# EAGLE design 220nF (EAGLE 9.6.2)

## Sheet 1 of 2
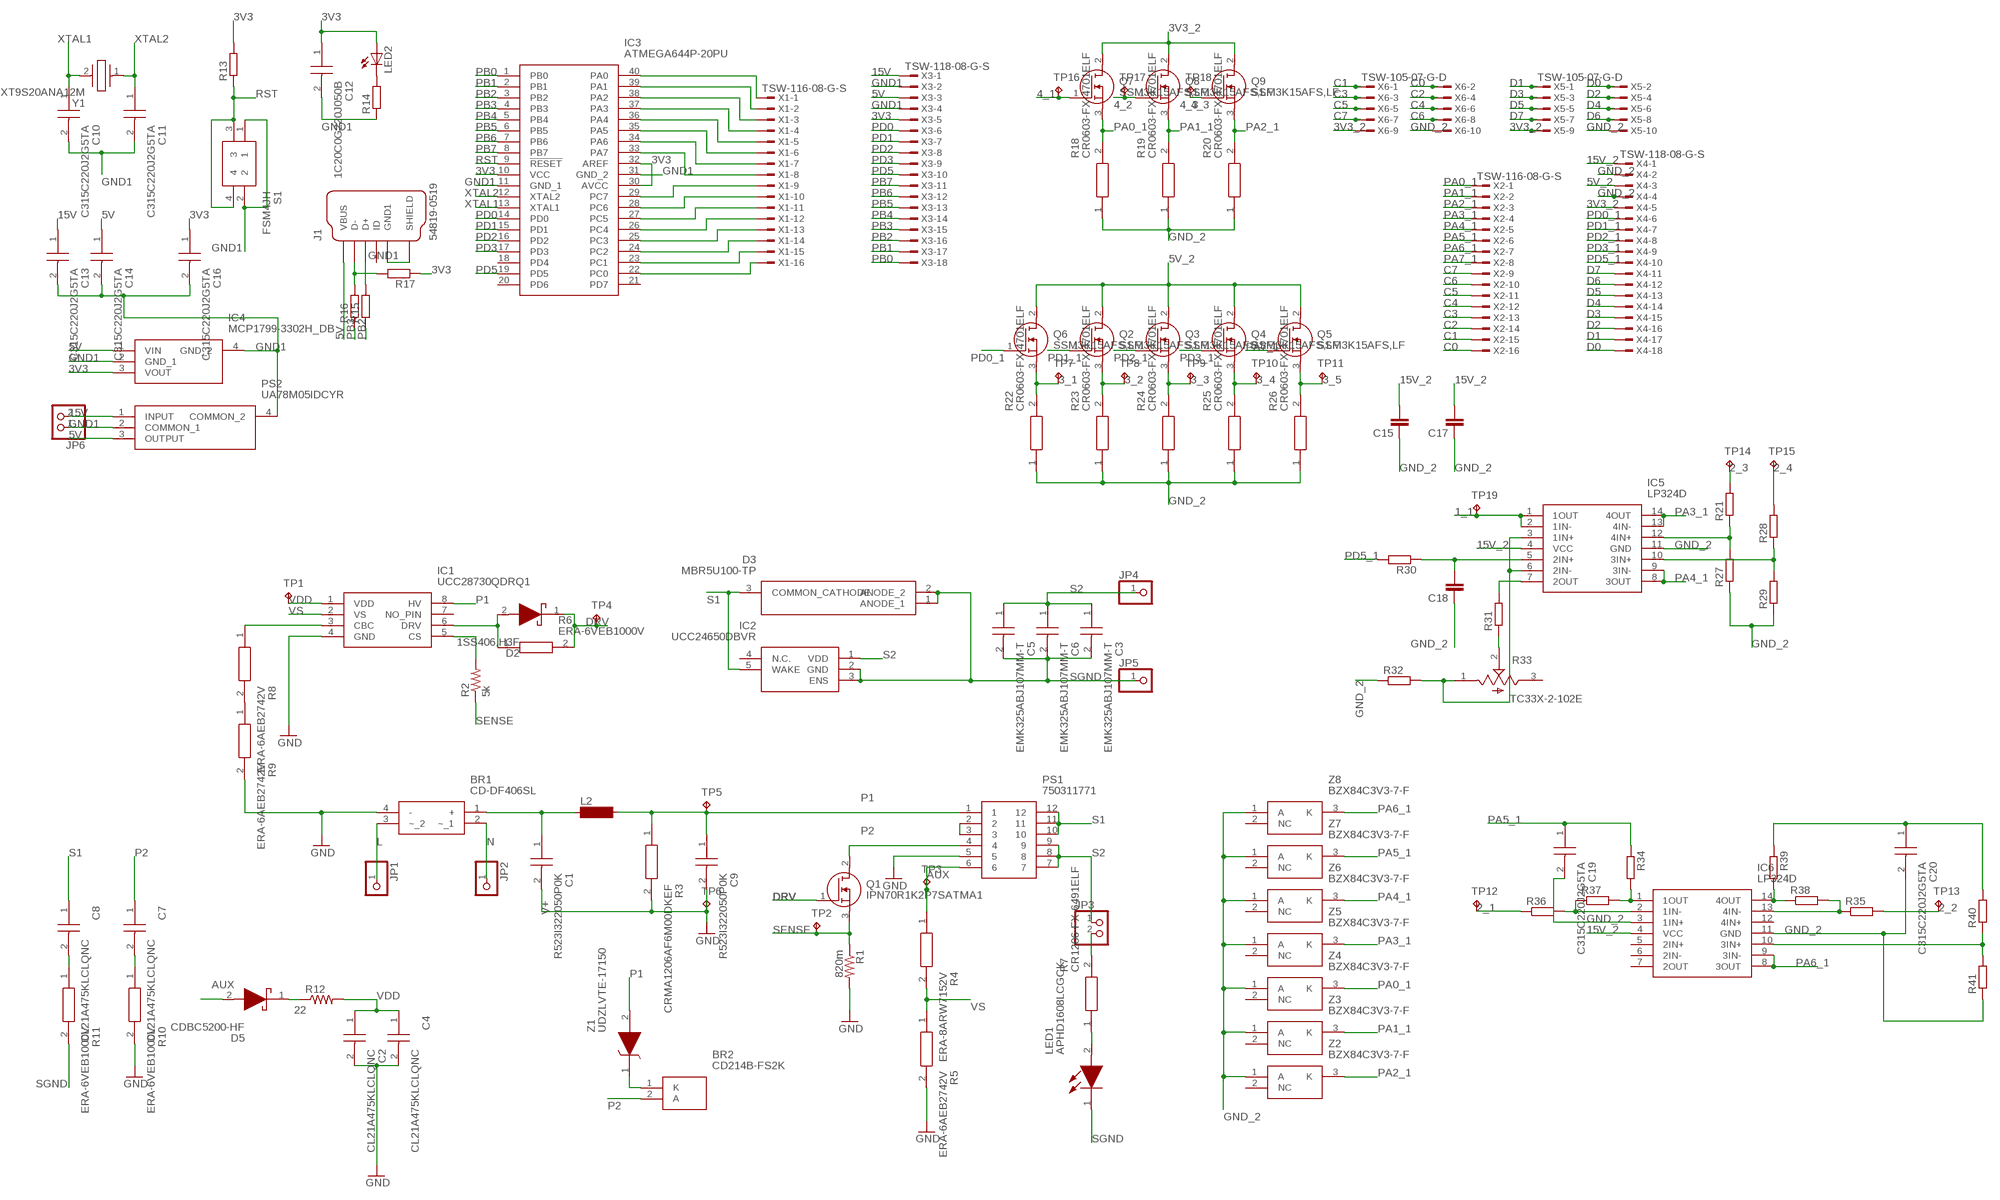
[diagram p0: schematic, sheet 1]

### Parts
BR1  CD-DF406SL  [CDDF406SL]
BR2  CD214B-FS2K  [CD214BFS2K]
C1  R523I322050P0K  [HDRV2W65P0X1500_1X2_1790X585X1]
C2  CL21A475KLCLQNC  [CAPC2012X95N]
C3  EMK325ABJ107MM-T  [CAPC3225X270N]
C4  CL21A475KLCLQNC  [CAPC2012X95N]
C5  EMK325ABJ107MM-T  [CAPC3225X270N]
C6  EMK325ABJ107MM-T  [CAPC3225X270N]
C7  CL21A475KLCLQNC  [CAPC2012X95N]
C8  CL21A475KLCLQNC  [CAPC2012X95N]
C9  R523I322050P0K  [HDRV2W65P0X1500_1X2_1790X585X1]
C10  C315C220J2G5TA  [C315]
C11  C315C220J2G5TA  [C315]
C12  1C20C0G220J050B  [1C20C0G220J050B]
C13  C315C220J2G5TA  [C315]
C14  C315C220J2G5TA  [C315]
C15  C-EUC0805  [C0805]
C16  C315C220J2G5TA  [C315]
C17  C-EUC0805  [C0805]
C18  C-EUC0805  [C0805]
C19  C315C220J2G5TA  [C315]
C20  C315C220J2G5TA  [C315]
D2  1SS406,H3F  [SOD2513X115N]
D3  MBR5U100-TP  [MBR5U100TP]
D5  CDBC5200-HF  [DIOM8059X290N]
IC1  UCC28730QDRQ1  [SOIC127P600X175-8N]
IC2  UCC24650DBVR  [SOT95P280X145-5N]
IC3  ATMEGA644P-20PU  [DIP1556W56P254L5232H483Q40N]
IC4  MCP1799-3302H_DB  [SOT230P700X180-4N]
IC5  LP324D  [SOIC127P600X175-14N]
IC6  LP324D  [SOIC127P600X175-14N]
J1  54819-0519  [MOLEX_54819-0519]
JP1  PINHD-1X1  [1X01]
JP2  PINHD-1X1  [1X01]
JP3  PINHD-1X2  [1X02]
JP4  PINHD-1X1  [1X01]
JP5  PINHD-1X1  [1X01]
JP6  PINHD-1X2  [1X02]
L2  MS50SRU1048-471Y  [INDDFN1000X1000X480-2N]
LED1  APHD1608LCGCK  [LEDM168X80N]
LED2  LED3MM  [LED3MM]
PS1  750311771  [750311771]
PS2  UA78M05IDCYR  [SOT230P700X180-4N]
Q1  IPN70R1K2P7SATMA1  [IPN70R1K2P7SATMA1]
Q2  SSM3K15AFS,LF  [SOT50P160X90-3N]
Q3  SSM3K15AFS,LF  [SOT50P160X90-3N]
Q4  SSM3K15AFS,LF  [SOT50P160X90-3N]
Q5  SSM3K15AFS,LF  [SOT50P160X90-3N]
Q6  SSM3K15AFS,LF  [SOT50P160X90-3N]
Q7  SSM3K15AFS,LF  [SOT50P160X90-3N]
Q8  SSM3K15AFS,LF  [SOT50P160X90-3N]
Q9  SSM3K15AFS,LF  [SOT50P160X90-3N]
R1  820m  R-US_R0805  [R0805]
R2  5k  R-US_R0805  [R0805]
R3  CRMA1206AF6M00DKEF  [RESC3216X74N]
R4  ERA-8ARW7152V  [ERA8A_(0805)]
R5  ERA-6AEB2742V  [ERA6A_(0805)]
R6  ERA-6VEB1000V  [ERA6VK]
R7  CR1206-FX-6491ELF  [RESC3216X75N]
R8  ERA-6AEB2742V  [ERA6A_(0805)]
R9  ERA-6AEB2742V  [ERA6A_(0805)]
R10  ERA-6VEB1000V  [ERA6VK]
R11  ERA-6VEB1000V  [ERA6VK]
R12  22  R-US_R0805  [R0805]
R13  R-EU_0204/7  [0204/7]
R14  R-EU_0204/7  [0204/7]
R15  R-EU_0204/7  [0204/7]
R16  R-EU_0204/7  [0204/7]
R17  R-EU_0204/7  [0204/7]
R18  CR0603-FX-4701ELF  [RESC1608X55N]
R19  CR0603-FX-4701ELF  [RESC1608X55N]
R20  CR0603-FX-4701ELF  [RESC1608X55N]
R21  R-EU_R0805  [R0805]
R22  CR0603-FX-4701ELF  [RESC1608X55N]
R23  CR0603-FX-4701ELF  [RESC1608X55N]
R24  CR0603-FX-4701ELF  [RESC1608X55N]
R25  CR0603-FX-4701ELF  [RESC1608X55N]
R26  CR0603-FX-4701ELF  [RESC1608X55N]
R27  R-EU_R0805  [R0805]
R28  R-EU_R0805  [R0805]
R29  R-EU_R0805  [R0805]
R30  R-EU_R0805  [R0805]
R31  R-EU_R0805  [R0805]
R32  R-EU_R0805  [R0805]
R33  TC33X-2-102E  [TRIM_TC33X-2-102E]
R34  R-EU_0204/7  [0204/7]
R35  R-EU_R0805  [R0805]
R36  R-EU_R0805  [R0805]
R37  R-EU_R0805  [R0805]
R38  R-EU_R0805  [R0805]
R39  R-EU_0204/7  [0204/7]
R40  R-EU_R0805  [R0805]
R41  R-EU_R0805  [R0805]
S1  FSM4JH  [FSM4JH]
TP1  TPB1,27  [B1,27]
TP2  TPB1,27  [B1,27]
TP3  TPB1,27  [B1,27]
TP4  TPB1,27  [B1,27]
TP5  TPB1,27  [B1,27]
TP6  TPB1,27  [B1,27]
TP7  TPB1,27  [B1,27]
TP8  TPB1,27  [B1,27]
TP9  TPB1,27  [B1,27]
TP10  TPB1,27  [B1,27]
TP11  TPB1,27  [B1,27]
TP12  TPB1,27  [B1,27]
TP13  TPB1,27  [B1,27]
TP14  TPB1,27  [B1,27]
TP15  TPB1,27  [B1,27]
TP16  TPB1,27  [B1,27]
TP17  TPB1,27  [B1,27]
TP18  TPB1,27  [B1,27]
TP19  TPB1,27  [B1,27]
X1  TSW-116-08-G-S  [TSW-116-XX-G-S]
X2  TSW-116-08-G-S  [TSW-116-XX-G-S]
X3  TSW-118-08-G-S  [TSW-118-XX-G-S]
X4  TSW-118-08-G-S  [TSW-118-XX-G-S]
X5  TSW-105-07-G-D  [TSW-105-XX-G-D]
X6  TSW-105-07-G-D  [TSW-105-XX-G-D]
Y1  XT9S20ANA12M  [XT9S20ANA12M]
Z1  UDZLVTE-17150  [SODFL2512X90N]
Z2  BZX84C3V3-7-F  [SOT96P240X120-3N]
Z3  BZX84C3V3-7-F  [SOT96P240X120-3N]
Z4  BZX84C3V3-7-F  [SOT96P240X120-3N]
Z5  BZX84C3V3-7-F  [SOT96P240X120-3N]
Z6  BZX84C3V3-7-F  [SOT96P240X120-3N]
Z7  BZX84C3V3-7-F  [SOT96P240X120-3N]
Z8  BZX84C3V3-7-F  [SOT96P240X120-3N]

### Nets
1_1: IC5.1(1OUT) IC5.2(1IN-) TP19.TP
2_1: R36.1 TP12.TP
2_2: R35.2 TP13.TP
2_3: R21.2 TP14.TP
2_4: R28.2 TP15.TP
3_1: Q6.3(S) R22.2 TP7.TP
3_2: Q2.3(S) R23.2 TP8.TP
3_3: Q3.3(S) R24.2 TP9.TP
3_4: Q4.3(S) R25.2 TP10.TP
3_5: Q5.3(S) R26.2 TP11.TP
3V3: C12.1 C16.1 IC3.10(VCC) IC3.30(AVCC) IC3.32(AREF) IC4.3(VOUT) LED2.A R13.2 R17.1 X3.5
3V3_2: Q7.2(D) Q8.2(D) Q9.2(D) X4.5 X5.9 X6.9
4_1: Q7.1(G) TP16.TP
4_2: Q8.1(G) TP17.TP
4_3: Q9.1(G) TP18.TP
5V: C14.1 IC4.1(VIN) J1.1(VBUS) J1.6(VBUS) PS2.3(OUTPUT) X3.3
5V_2: Q2.2(D) Q3.2(D) Q4.2(D) Q5.2(D) Q6.2(D) X4.3
15V: C13.1 JP6.2 PS2.1(INPUT) X3.1
15V_2: C15.2 C17.2 IC5.4(VCC) IC6.4(VCC) X4.1
AUX: D5.2(A) PS1.6 R4.1 TP3.TP
C0: X2.16 X6.2
C1: X2.15 X6.1
C2: X2.14 X6.4
C3: X2.13 X6.3
C4: X2.12 X6.6
C5: X2.11 X6.5
C6: X2.10 X6.8
C7: X2.9 X6.7
D0: X4.18 X5.2
D1: X4.17 X5.1
D2: X4.16 X5.4
D3: X4.15 X5.3
D4: X4.14 X5.6
D5: X4.13 X5.5
D6: X4.12 X5.8
D7: X4.11 X5.7
DRV: D2.1(K) Q1.1(G) R6.2 TP4.TP
GND: BR1.4(-) C1.2 C2.2 C4.2 C9.2 IC1.4(GND) PS1.5 R1.2 R3.2 R5.2 R9.2 R10.2 TP6.TP
GND1: C10.2 C11.2 C12.2 C13.2 C14.2 C16.2 IC3.11(GND_1) IC3.31(GND_2) IC4.2(GND_1) IC4.4(GND_2) J1.5(GND1) J1.10(GND1) J1.11(SHIELD) J1.12(SHIELD) J1.S1(SHIELD) J1.S2(SHIELD) JP6.1 PS2.2(COMMON_1) PS2.4(COMMON_2) R14.1 S1.1 S1.2 X3.2 X3.4
GND_2: C15.1 C17.1 C18.1 C19.2 C20.2 IC5.11(GND) IC6.3(1IN+) IC6.11(GND) R18.1 R19.1 R20.1 R22.1 R23.1 R24.1 R25.1 R26.1 R27.1 R29.1 R32.1 R41.1 X4.2 X4.4 X5.10 X6.10 Z2.1(A) Z3.1(A) Z4.1(A) Z5.1(A) Z6.1(A) Z7.1(A) Z8.1(A)
L: BR1.3(~_2) JP1.1
N: BR1.2(~_1) JP2.1
N$1: IC1.5(CS) R2.2
N$2: C7.2 R10.1
N$3: C8.2 R11.1
N$4: D5.1(K) R12.1
N$5: PS1.2 PS1.3
N$6: BR2.1(K) Z1.1(K)
N$7: D2.2(A) IC1.6(DRV) R6.1
N$8: R8.2 R9.1
N$9: LED1.2(A) R7.1
N$10: IC1.3(CBC) R8.1
N$11: JP3.2 R7.2
N$12: IC3.40(PA0) X1.1
N$13: IC3.39(PA1) X1.2
N$14: IC3.38(PA2) X1.3
N$15: IC3.37(PA3) X1.4
N$16: IC3.36(PA4) X1.5
N$17: IC3.35(PA5) X1.6
N$18: IC3.34(PA6) X1.7
N$19: IC3.33(PA7) X1.8
N$20: IC3.22(PC0) X1.16
N$21: IC3.23(PC1) X1.15
N$22: IC3.24(PC2) X1.14
N$23: IC3.25(PC3) X1.13
N$24: IC3.26(PC4) X1.12
N$25: IC3.27(PC5) X1.11
N$26: IC3.28(PC6) X1.10
N$27: IC3.29(PC7) X1.9
N$28: LED2.K(C) R14.2
N$29: J1.3(D+) J1.8(D+) R15.2
N$30: J1.2(D-) J1.7(D-) R16.2 R17.2
N$31: C18.2 IC5.5(2IN+) R30.1
N$32: IC5.7(2OUT) R31.2
N$33: IC5.12(4IN+) R21.1 R27.2
N$34: IC5.10(3IN+) R28.1 R29.2
N$35: IC5.3(1IN+) IC5.6(2IN-) R32.2 R33.1(CCW)
N$36: R31.1 R33.2(W)
N$37: IC6.14(4OUT) R38.1 R39.2
N$39: IC6.13(4IN-) R35.1 R38.2
N$40: IC6.2(1IN-) R36.2 R37.1
N$41: IC6.1(1OUT) R34.2 R37.2
N$42: C20.1 R39.1 R40.2
N$43: IC6.10(3IN+) R40.1 R41.2
P1: C9.1 IC1.8(HV) L2.2 PS1.1 R3.1 TP5.TP Z1.2(A)
P2: BR2.2(A) C7.1 PS1.4 Q1.2(D)
PA0_1: Q7.3(S) R18.2 X2.1 Z4.3(K)
PA1_1: Q8.3(S) R19.2 X2.2 Z3.3(K)
PA2_1: Q9.3(S) R20.2 X2.3 Z2.3(K)
PA3_1: IC5.13(4IN-) IC5.14(4OUT) X2.4 Z5.3(K)
PA4_1: IC5.8(3OUT) IC5.9(3IN-) X2.5 Z6.3(K)
PA5_1: C19.1 R34.1 X2.6 Z7.3(K)
PA6_1: IC6.8(3OUT) IC6.9(3IN-) X2.7 Z8.3(K)
PA7_1: Q5.1(G) X2.8
PB0: IC3.1(PB0) X3.18
PB1: IC3.2(PB1) X3.17
PB2: IC3.3(PB2) R15.1 X3.16
PB3: IC3.4(PB3) R16.1 X3.15
PB4: IC3.5(PB4) X3.14
PB5: IC3.6(PB5) X3.13
PB6: IC3.7(PB6) X3.12
PB7: IC3.8(PB7) X3.11
PD0: IC3.14(PD0) X3.6
PD0_1: Q6.1(G) X4.6
PD1: IC3.15(PD1) X3.7
PD1_1: Q2.1(G) X4.7
PD2: IC3.16(PD2) X3.8
PD2_1: Q3.1(G) X4.8
PD3: IC3.17(PD3) X3.9
PD3_1: Q4.1(G) X4.9
PD5: IC3.19(PD5) X3.10
PD5_1: R30.2 X4.10
RST: IC3.9(!RESET) R13.1 S1.3 S1.4
S1: C8.1 D3.3(COMMON_CATHODE) IC2.5(WAKE) PS1.10 PS1.11 PS1.12
S2: C3.1 C5.1 C6.1 IC2.1(VDD) JP3.1 JP4.1 PS1.7 PS1.8 PS1.9
SENSE: Q1.3(S) R1.1 R2.1 TP2.TP
SGND: C3.2 C5.2 C6.2 D3.1(ANODE_1) D3.2(ANODE_2) IC2.2(GND) IC2.3(ENS) JP5.1 LED1.1(K) R11.2
V+: BR1.1(+) C1.1 L2.1
VDD: C2.1 C4.1 IC1.1(VDD) R12.2 TP1.TP
VS: IC1.2(VS) R4.2 R5.1
XTAL1: C10.1 IC3.13(XTAL1) Y1.2
XTAL2: C11.1 IC3.12(XTAL2) Y1.1
Unconnected: IC1.7(NO_PIN) IC2.4(N.C.) IC3.18(PD4) IC3.20(PD6) IC3.21(PD7) IC6.5(2IN+) IC6.6(2IN-) IC6.7(2OUT) IC6.12(4IN+) J1.4(ID) J1.9(ID) R33.3(CW) Z2.2(NC) Z3.2(NC) Z4.2(NC) Z5.2(NC) Z6.2(NC) Z7.2(NC) Z8.2(NC)

## Sheet 2 of 2

## Library data of the parts
BR1 = CD-DF406SL:CD-DF406SL: Bridge Rectifiers VRRM 600V 4A SMD DFS Bridge Rectifier Source: Datasheet <http://www.bourns.com/docs/Product-Datasheets/CD-DF4xxSL.pdf>; DESCRIPTION: Bridge Rectifiers VRRM 600V 4A SMD DFS Bridge Rectifier; HEIGHT: 1.55mm; MANUFACTURER_NAME: Bourns; MANUFACTURER_PART_NUMBER: CD-DF406SL; MOUSER_PART_NUMBER: 652-CD-DF406SL; MOUSER_PRICE-STOCK: https://www.mouser.co.uk/ProductDetail/Bourns/CD-DF406SL?qs=zwwtnr6GuIwJRuaaRN0u3A%3D%3D
BR2 = CD214B-FS2K:CD214B-FS2K: Rectifiers 800V 2A Source: Datasheet <http://www.bourns.com/docs/product-datasheets/CD214B-FS2x.pdf>; DESCRIPTION: Rectifiers 800V 2A; HEIGHT: 1.25mm; MANUFACTURER_NAME: Bourns; MANUFACTURER_PART_NUMBER: CD214B-FS2K; MOUSER_PART_NUMBER: 652-CD214B-FS2K; MOUSER_PRICE-STOCK: https://www.mouser.co.uk/ProductDetail/Bourns/CD214B-FS2K?qs=f9yNj16SXrLQSBa%252BXyEv0g%3D%3D
C1 C9 = R523I322050P0K:R523I322050P0K: R52 310 VAC MINI, Film, Metallized Polypropylene, Automotive Safety, 0.22 uF, 10%, 310 VAC, 310 VAC (X2), 310 VAC, 630 VDC, 110C, -40C, 110C, 0.2 % , 100 GOhms, 400 V/us, 2, 1.6 g, 18mm, 12mm, 6mm, Lead Spacing = 15mm, 900 Source: Datasheet <https://content.kemet.com/datasheets/KEM_F3123_R52_X2_310_110C_MIN.pdf>; DESCRIPTION: R52 310 VAC MINI, Film, Metallized Polypropylene, Automotive Safety, 0.22 uF, 10%, 310 VAC, 310 VAC (X2), 310 VAC, 630 VDC, 110C, -40C, 110C, 0.2 % , 100 GOhms, 400 V/us, 2, 1.6 g, 18mm, 12mm, 6mm, Lead Spacing = 15mm, 900; HEIGHT: 12.4mm; MANUFACTURER_NAME: KEMET; MANUFACTURER_PART_NUMBER: R523I322050P0K
C2 C4 C7 C8 = CL21A475KLCLQNC:CL21A475KLCLQNC: CL21A475KLCLQNC Source: Datasheet <https://datasheet.datasheetarchive.com/originals/dk/DKDS-19/374306.pdf>; DESCRIPTION: CL21A475KLCLQNC; HEIGHT: 0.95mm; MANUFACTURER_NAME: SAMSUNG; MANUFACTURER_PART_NUMBER: CL21A475KLCLQNC; MOUSER_PART_NUMBER: 187-CL21A475KLCLQNC; MOUSER_PRICE-STOCK: https://www.mouser.co.uk/ProductDetail/Samsung-Electro-Mechanics/CL21A475KLCLQNC?qs=xZ%2FP%252Ba9zWqblbGH9u%2F3CcQ%3D%3D
C3 C5 C6 = EMK325ABJ107MM-T:EMK325ABJ107MM-T: TAIYO YUDEN - EMK325ABJ107MM-T - CAP, MLCC, X5R, 100UF, 16V, 1210 Source: Datasheet <https://componentsearchengine.com/Datasheets/2/EMK325ABJ107MM-T.pdf>; DESCRIPTION: TAIYO YUDEN - EMK325ABJ107MM-T - CAP, MLCC, X5R, 100UF, 16V, 1210; HEIGHT: 2.7mm; MANUFACTURER_NAME: TAIYO YUDEN; MANUFACTURER_PART_NUMBER: EMK325ABJ107MM-T; MOUSER_PART_NUMBER: 963-EMK325ABJ107MM-T; MOUSER_PRICE-STOCK: https://www.mouser.co.uk/ProductDetail/Taiyo-Yuden/EMK325ABJ107MM-T?qs=I6KAKw0tg2y0ShKbEoYruw%3D%3D
C10 C11 C13 C14 C16 C19 C20 = C315C220J2G5TA:C315C220J2G5TA: GoldMax 300 Comm C0G, Ceramic, 22 pF, 5%, 200 VDC, 500 VDC, 125C, -55C, C0G, GoldMax, Commercial Standard, 0.1 % , 100 GOhms, 3.81mm, 3.14mm, 2.54mm, Lead Spacing = 2.54mm, 7mm, 0.51mm, 500, 120 Source: Datasheet <https://content.kemet.com/datasheets/KEM_C1049_GOLDMAX_C0G.pdf>; DESCRIPTION: GoldMax 300 Comm C0G, Ceramic, 22 pF, 5%, 200 VDC, 500 VDC, 125C, -55C, C0G, GoldMax, Commercial Standard, 0.1 % , 100 GOhms, 3.81mm, 3.14mm, 2.54mm, Lead Spacing = 2.54mm, 7mm, 0.51mm, 500, 120; HEIGHT: 3.14mm; MANUFACTURER_NAME: KEMET; MANUFACTURER_PART_NUMBER: C315C220J2G5TA; MOUSER_PART_NUMBER: 80-C315C220J2G; MOUSER_PRICE-STOCK: https://www.mouser.co.uk/ProductDetail/KEMET/C315C220J2G5TA?qs=6DDjpUaD9G3WE9%2F2Ct37CQ%3D%3D
C12 = 1C20C0G220J050B:1C20C0G220J050B: 22pF +/-5% 50V Ceramic Capacitor C0G, NP0 Radial Source: Datasheet <https://media.digikey.com/pdf/Data Sheets/BC Components PDFs/1C-9C_Series_Rev_Sep_2015.pdf>; DESCRIPTION: 22pF +/-5% 50V Ceramic Capacitor C0G, NP0 Radial; HEIGHT: 6.35mm; MANUFACTURER_NAME: Vishay; MANUFACTURER_PART_NUMBER: 1C20C0G220J050B; MOUSER_PART_NUMBER: 75-1C20C0G220J050B; MOUSER_PRICE-STOCK: https://www.mouser.co.uk/ProductDetail/Vishay-Sprague/1C20C0G220J050B?qs=So2q653Ab4nrWddw6vx7vg%3D%3D
C15 C17 C18 = rcl:C-EU: CAPACITOR, European symbol; SPICEPREFIX: C
D2 = 1SS406_H3F:1SS406,H3F: Small Signal Schottky Barrier Diode VR=20V, IO=0.05A, in SOD-323 package Source: Datasheet <https://www.mouser.fr/datasheet/2/408/1SS406_datasheet_en_20140301-1853419.pdf>; DESCRIPTION: Small Signal Schottky Barrier Diode VR=20V, IO=0.05A, in SOD-323 package; HEIGHT: 1.15mm; MANUFACTURER_NAME: Toshiba; MANUFACTURER_PART_NUMBER: 1SS406,H3F; MOUSER_PART_NUMBER: 757-1SS406H3F; MOUSER_PRICE-STOCK: https://www.mouser.co.uk/ProductDetail/Toshiba/1SS406H3F?qs=bZr6mbWTK5l7KVDflTlTGA%3D%3D
D3 = MBR5U100-TP:MBR5U100-TP: Diode Schottky 100 V 5A Surface Mount TO-277 Source: Datasheet <https://www.mccsemi.com/pdf/Products/MBR5U100(TO-277).pdf>; DESCRIPTION: Diode Schottky 100 V 5A Surface Mount TO-277; HEIGHT: 1.2mm; MANUFACTURER_NAME: MCC; MANUFACTURER_PART_NUMBER: MBR5U100-TP
D5 = CDBC5200-HF:CDBC5200-HF: Diode 200 V 5A Surface Mount DO-214AB (SMC) Source: Datasheet <https://www.comchiptech.com/admin/files/product/CDBC5150-HF Thru913202. CDBC5200-HF RevB.pdf>; DESCRIPTION: Diode 200 V 5A Surface Mount DO-214AB (SMC); HEIGHT: 2.9mm; MANUFACTURER_NAME: Comchip Technology; MANUFACTURER_PART_NUMBER: CDBC5200-HF; MOUSER_PART_NUMBER: 750-CDBC5200-HF; MOUSER_PRICE-STOCK: https://www.mouser.co.uk/ProductDetail/Comchip-Technology/CDBC5200-HF?qs=XEIV%2Fho1H6e7FEPE4wQmfQ%3D%3D
IC1 = UCC28730QDRQ1:UCC28730QDRQ1: Zero-Power Standby PSR Flyback Controller for Automotive Source: Datasheet <http://www.ti.com/lit/gpn/ucc28730-q1>; DESCRIPTION: Zero-Power Standby PSR Flyback Controller for Automotive; HEIGHT: 1.75mm; MANUFACTURER_NAME: Texas Instruments; MANUFACTURER_PART_NUMBER: UCC28730QDRQ1; MOUSER_PART_NUMBER: 595-UCC28730QDRQ1; MOUSER_PRICE-STOCK: https://www.mouser.co.uk/ProductDetail/Texas-Instruments/UCC28730QDRQ1?qs=HXFqYaX1Q2wArPNWbLj35A%3D%3D
IC2 = UCC24650DBVR:UCC24650DBVR: 200-V Wake-up Monitor for Fast Transient Primary-side Regulation Source: Datasheet <http://www.ti.com/lit/gpn/ucc24650>; DESCRIPTION: 200-V Wake-up Monitor for Fast Transient Primary-side Regulation; HEIGHT: 1.45mm; MANUFACTURER_NAME: Texas Instruments; MANUFACTURER_PART_NUMBER: UCC24650DBVR; MOUSER_PART_NUMBER: 595-UCC24650DBVR; MOUSER_PRICE-STOCK: https://www.mouser.co.uk/ProductDetail/Texas-Instruments/UCC24650DBVR?qs=Lb6%252B0IsOw48DAHpAvVALpw%3D%3D
IC3 = ATMEGA644P-20PU:ATMEGA644P-20PU: 8-bit MCU Source: Datasheet; DESCRIPTION: 8-bit MCU; HEIGHT: 4.826mm; MANUFACTURER_NAME: Microchip; MANUFACTURER_PART_NUMBER: ATMEGA644P-20PU; MOUSER_PART_NUMBER: 556-ATMEGA644P-20PU; MOUSER_PRICE-STOCK: https://www.mouser.co.uk/ProductDetail/Microchip-Technology-Atmel/ATMEGA644P-20PU?qs=b1J4i6otjZszsgv9nk2ACg%3D%3D
IC4 = 3v3:MCP1799-3302H_DB: LDO Voltage Regulators High Voltage LDO 3.3V 3-Ld SOT-223 Tube Source: Datasheet <https://datasheet.datasheetarchive.com/originals/distributors/Datasheets_SAMA/2add369fe97b3d22cf8b2b374aafb195.pdf>; DESCRIPTION: LDO Voltage Regulators High Voltage LDO 3.3V 3-Ld SOT-223 Tube; HEIGHT: 1.8mm; MANUFACTURER_NAME: Microchip; MANUFACTURER_PART_NUMBER: MCP1799-3302H/DB; MOUSER_PART_NUMBER: 579-MCP1799-3302H/DB; MOUSER_PRICE-STOCK: https://www.mouser.co.uk/ProductDetail/Microchip-Technology-Atmel/MCP1799-3302H-DB?qs=BJlw7L4Cy7%2Fcz2TtAqJdSg%3D%3D
IC5 IC6 = LP324D:LP324D: Texas Instruments LP324D, Quad Op Amp, 0.1MHz, 5 28 V, 14-Pin SOIC Source: Datasheet <https://www.ti.com/lit/ds/symlink/lp324.pdf?ts=1617974975875&ref_url=https%3A%2F%2Fwww.ti.com%2Fproduct%2FLP324>; DESCRIPTION: Texas Instruments LP324D, Quad Op Amp, 0.1MHz, 5 28 V, 14-Pin SOIC; HEIGHT: 1.75mm; MANUFACTURER_NAME: Texas Instruments; MANUFACTURER_PART_NUMBER: LP324D; MOUSER_PART_NUMBER: 595-LP324D; MOUSER_PRICE-STOCK: https://www.mouser.com/Search/Refine.aspx?Keyword=595-LP324D
J1 = 54819-0519:54819-0519: USB - mini B USB 2.0 OTG Receptacle Connector 5 Position Through Hole, Right Angle Check availability <https://pricing.snapeda.com/parts/54819-0519/Molex/view-part?ref=eda>; AVAILABILITY: In Stock; DESCRIPTION: USB - mini B USB 2.0 OTG Receptacle Connector 5 Position Through Hole, Right Angle; MF: Molex; MP: 54819-0519; PACKAGE: None; PRICE: None; PURCHASE-URL: https://pricing.snapeda.com/search/part/54819-0519/?ref=eda
JP1 JP2 JP4 JP5 = adafruit:PINHD-1X1: Pin header 1x1 for 0.1" spacing With round pins
JP3 JP6 = pinhead:PINHD-1X2: PIN HEADER
L2 = inductor-neosid:MS50: INDUCTOR SMD power inductor
LED1 = APHD1608LCGCK:APHD1608LCGCK: Standard LEDs - SMD 0603 Dome Lens LED Green- 570nm Source: Datasheet <http://www.kingbrightusa.com/images/catalog/SPEC/APHD1608LCGCK.pdf>; DESCRIPTION: Standard LEDs - SMD 0603 Dome Lens LED Green- 570nm; HEIGHT: 0.8mm; MANUFACTURER_NAME: Kingbright; MANUFACTURER_PART_NUMBER: APHD1608LCGCK; MOUSER_PART_NUMBER: 604-APHD1608LCGCK; MOUSER_PRICE-STOCK: https://www.mouser.co.uk/ProductDetail/Kingbright/APHD1608LCGCK?qs=AQlKX63v8RvqPbV1LDSVuw%3D%3D
LED2 = adafruit:LED: LED OSRAM: - CHIPLED LG R971, LG N971, LY N971, LG Q971, LY Q971, LO R971, LY R971 LH N974, LH R974 LS Q976, LO Q976, LY Q976 LO Q996 - Hyper CHIPLED LW Q18S LB Q993, LB Q99A, LB R99A - SideLED LS A670, LO A670, LY A670, LG A670, LP A670 LB A673, LV A673, LT A673, LW A673 LH A674 LY A675 LS A676, LA A676, LO A676, LY A676, LW A676 LS A679, LY A679, LG A679 - Hyper Micro SIDELED® LS Y876, LA Y876, LO Y876, LY Y876 LT Y87S - SmartLED LW L88C, LW L88S LB L89C, LB L89S, LG L890 LS L89K, LO L89K, LY L89K LS L896, LA L896, LO L896, LY L896 - TOPLED LS T670, LO T670, LY T670, LG T670, LP T670 LSG T670, LSP T670, LSY T670, LOP T670, LYG T670 LG T671, LOG T671, LSG T671 LB T673, LV T673, LT T673, LW T673 LH T674 LS T676, LA T676, LO T676, LY T676, LB T676, LH T676, LSB T676, LW T676 LB T67C, LV T67C, LT T67C, LS T67K, LO T67K, LY T67K, LW E67C LS E67B, LA E67B, LO E67B, LY E67B, LB E67C, LV E67C, LT E67C LW T67C LS T679, LY T679, LG T679 LS T770, LO T770, LY T770, LG T770, LP T770 LB T773, LV T773, LT T773, LW T773 LH T774 LS E675, LA E675, LY E675, LS T675 LS T776, LA T776, LO T776, LY T776, LB T776 LHGB T686 LT T68C, LB T68C - Hyper Mini TOPLED® LB M676 - Mini TOPLED Santana® LG M470 LS M47K, LO M47K, LY M47K Source: http://www.osram.convergy.de/
PS1 = 750311771:750311771: Power Transformers WE-FB Flyback 500uH 3A 15V Source: Datasheet <https://katalog.we-online.com/pbs/datasheet/750311771.pdf>; DESCRIPTION: Power Transformers WE-FB Flyback 500uH 3A 15V; HEIGHT: 13.69mm; MANUFACTURER_NAME: Wurth Elektronik; MANUFACTURER_PART_NUMBER: 750311771; MOUSER_PART_NUMBER: 710-750311771; MOUSER_PRICE-STOCK: https://www.mouser.co.uk/ProductDetail/Wurth-Elektronik/750311771?qs=J4sk5G6CMwYUnCXRsU%2FeCw%3D%3D; SPICEPREFIX: X
PS2 = UA78M05IDCYR:UA78M05IDCYR: 500-mA, 25-V, Linear Voltage Regulators Source: Datasheet <http://www.ti.com/lit/gpn/ua78m>; DESCRIPTION: 500-mA, 25-V, Linear Voltage Regulators; HEIGHT: 1.8mm; MANUFACTURER_NAME: Texas Instruments; MANUFACTURER_PART_NUMBER: UA78M05IDCYR; MOUSER_PART_NUMBER: 595-UA78M05IDCYR; MOUSER_PRICE-STOCK: https://www.mouser.co.uk/ProductDetail/Texas-Instruments/UA78M05IDCYR?qs=0O%2FZFlpUpJXf0Y5v1qo1ow%3D%3D
Q1 = IPN70R1K2P7SATMA1:IPN70R1K2P7SATMA1: N-Channel 700 V 4.5A (Tc) 6.3W (Tc) Surface Mount PG-SOT223 Source: Datasheet <https://www.infineon.com/dgdl/Infineon-IPN70R1K2P7S-DS-v02_00-EN.pdf?fileId=5546d4625f2e26bc015f524b972d6b74>; DESCRIPTION: N-Channel 700 V 4.5A (Tc) 6.3W (Tc) Surface Mount PG-SOT223; HEIGHT: 1.8mm; MANUFACTURER_NAME: Infineon; MANUFACTURER_PART_NUMBER: IPN70R1K2P7SATMA1; MOUSER_PART_NUMBER: 726-IPN70R1K2P7SATM1; MOUSER_PRICE-STOCK: https://www.mouser.co.uk/ProductDetail/Infineon-Technologies/IPN70R1K2P7SATMA1?qs=W0yvOO0ixfF5ZdsayOLPrw%3D%3D
Q2-Q9 = SSM3K15AFS_LF:SSM3K15AFS,LF: MOSFET SM Sig N-CH MOS 30V 0.1A 20V VGSS Source: Datasheet <https://componentsearchengine.com/Datasheets/1/SSM3K15AFS,LF.pdf>; DESCRIPTION: MOSFET SM Sig N-CH MOS 30V 0.1A 20V VGSS; HEIGHT: 0.9mm; MANUFACTURER_NAME: Toshiba; MANUFACTURER_PART_NUMBER: SSM3K15AFS,LF; MOUSER_PART_NUMBER: 757-SSM3K15AFSLF; MOUSER_PRICE-STOCK: https://www.mouser.co.uk/ProductDetail/Toshiba/SSM3K15AFSLF?qs=%252B8yZ8wZTKG7AGhIhPkr1lQ%3D%3D
R1 R2 R12 = adafruit:R-US_: RESISTOR, American symbol
R3 = CRMA1206AF6M00DKEF:CRMA1206AF6M00DKEF: Thick Film Resistors - SMD 0.30W 6Mohm .5% AEC-Q200 Source: Datasheet <https://www.vishay.com/doc?68043>; DESCRIPTION: Thick Film Resistors - SMD 0.30W 6Mohm .5% AEC-Q200; HEIGHT: 0.74mm; MANUFACTURER_NAME: Vishay; MANUFACTURER_PART_NUMBER: CRMA1206AF6M00DKEF
R4 = ERA-8ARW7152V:ERA-8ARW7152V: Thin Film Resistors - SMD 1206 71.5Kohms 0.05% 0.25W 10ppm AEC-Q200 Source: Datasheet <https://componentsearchengine.com/Datasheets/1/ERA-8ARW7152V.pdf>; DESCRIPTION: Thin Film Resistors - SMD 1206 71.5Kohms 0.05% 0.25W 10ppm AEC-Q200; HEIGHT: 0.7mm; MANUFACTURER_NAME: Panasonic; MANUFACTURER_PART_NUMBER: ERA-8ARW7152V; MOUSER_PART_NUMBER: 667-ERA-8ARW7152V; MOUSER_PRICE-STOCK: https://www.mouser.com/Search/Refine.aspx?Keyword=667-ERA-8ARW7152V
R5 R8 R9 = ERA-6AEB2742V:ERA-6AEB2742V: Thin Film Resistors - SMD 0805 27.4Kohm 0.1% 25ppm Source: Datasheet <http://industrial.panasonic.com/cdbs/www-data/pdf/RDM0000/AOA0000C307.pdf>; DESCRIPTION: Thin Film Resistors - SMD 0805 27.4Kohm 0.1% 25ppm; HEIGHT: 0.6mm; MANUFACTURER_NAME: Panasonic; MANUFACTURER_PART_NUMBER: ERA-6AEB2742V; MOUSER_PART_NUMBER: 667-ERA-6AEB2742V; MOUSER_PRICE-STOCK: https://www.mouser.co.uk/ProductDetail/Panasonic/ERA-6AEB2742V?qs=nuXzIS8loXHdFK0i8oIpgw%3D%3D
R6 R10 R11 = ERA-6VEB1000V:ERA-6VEB1000V: Thin Film Chip Resistor, High Stability & Reliability, 0805, 0.25W Source: Datasheet <http://industrial.panasonic.com/cdbs/www-data/pdf/RDM0000/RDM0000C331.pdf>; DESCRIPTION: Thin Film Chip Resistor, High Stability & Reliability, 0805, 0.25W; HEIGHT: 0.65mm; MANUFACTURER_NAME: Panasonic; MANUFACTURER_PART_NUMBER: ERA-6VEB1000V; MOUSER_PART_NUMBER: 667-ERA-6VEB1000V; MOUSER_PRICE-STOCK: https://www.mouser.co.uk/ProductDetail/Panasonic/ERA-6VEB1000V?qs=rI7uf1IzohT7rLgO%252BB7NcQ%3D%3D
R7 = CR1206-FX-6491ELF:CR1206-FX-6491ELF: Thick Film Resistors - SMD 6.49K 1% Source: Datasheet <https://componentsearchengine.com/Datasheets/1/CR1206-FX-6491ELF.pdf>; DESCRIPTION: Thick Film Resistors - SMD 6.49K 1%; HEIGHT: 0.75mm; MANUFACTURER_NAME: Bourns; MANUFACTURER_PART_NUMBER: CR1206-FX-6491ELF; MOUSER_PART_NUMBER: 652-CR1206FX-6491ELF; MOUSER_PRICE-STOCK: https://www.mouser.com/Search/Refine.aspx?Keyword=652-CR1206FX-6491ELF
R13-R17 R21 R27-R32 R34-R41 = rcl:R-EU_: RESISTOR, European symbol; SPICEPREFIX: R
R18-R20 R22-R26 = CR0603-FX-4701ELF:CR0603-FX-4701ELF: SMD 0603 thick film resistor 4K7 1% Bourns CR0603-FX Series Thick Film Surface Mount Fixed Resistor 0603 Case 4.7k +/-1% 0.1W +/-100ppm/C Source: Datasheet <https://www.bourns.com/pdfs/chpreztr.pdf>; DESCRIPTION: SMD 0603 thick film resistor 4K7 1% Bourns CR0603-FX Series Thick Film Surface Mount Fixed Resistor 0603 Case 4.7k +/-1% 0.1W +/-100ppm/C; HEIGHT: 0.55mm; MANUFACTURER_NAME: Bourns; MANUFACTURER_PART_NUMBER: CR0603-FX-4701ELF; MOUSER_PART_NUMBER: 652-CR0603FX-4701ELF; MOUSER_PRICE-STOCK: https://www.mouser.co.uk/ProductDetail/Bourns/CR0603-FX-4701ELF?qs=CCIlxZRRv7jGwxSydcgiTA%3D%3D
R33 = TC33X-2-102E:TC33X-2-102E: Res Trimmer 100K Ohm 25% 1/10W 1(Elec)/1(Mech)Turn (3 X 3.8mm) Foot Print SMD Embossed T/R Check availability <https://pricing.snapeda.com/parts/TC33X-2-102E/Bourns/view-part?ref=eda>; AVAILABILITY: In Stock; DESCRIPTION: 1 kOhms 0.1W, 1/10W J Lead Surface Mount Trimmer Potentiometer Cermet 1.0 Turn Top Adjustment; MF: Bourns; MP: TC33X-2-102E; PACKAGE: 1608 Bourns; PRICE: None; PURCHASE-URL: https://pricing.snapeda.com/search/part/TC33X-2-102E/?ref=eda
S1 = FSM4JH:FSM4JH: 6x6mm tactile switch,5mm H 1.6N Black Button Tactile Switch, SPST-NO 50 mA@ 24 V dc 1.4mm Source: Datasheet <http://www.te.com/commerce/DocumentDelivery/DDEController?Action=showdoc&DocId=Customer Drawing1825910C9pdfEnglishENG_CD_1825910_C9.pdf1825910-6>; DESCRIPTION: 6x6mm tactile switch,5mm H 1.6N Black Button Tactile Switch, SPST-NO 50 mA@ 24 V dc 1.4mm; HEIGHT: mm; MANUFACTURER_NAME: TE Connectivity; MANUFACTURER_PART_NUMBER: FSM4JH; MOUSER_PART_NUMBER: 506-FSM4JH; MOUSER_PRICE-STOCK: https://www.mouser.co.uk/ProductDetail/TE-Connectivity-Alcoswitch/FSM4JH?qs=g%252BEszo6zu8OwVWrHD2r3Rw%3D%3D
TP1-TP19 = testpad:TP: Test pad
X1 X2 = con-samtec:TSW-116-*-G-S: THROUGH-HOLE .025" SQ POST HEADER Source: Samtec TSW.pdf; MF: Samtec Inc.; MPN: TSW-116-07-G-S
X3 X4 = con-samtec:TSW-118-*-G-S: THROUGH-HOLE .025" SQ POST HEADER Source: Samtec TSW.pdf; MF: Samtec Inc.; MPN: TSW-118-07-G-S
X5 X6 = con-samtec:TSW-105-*-G: THROUGH-HOLE .025" SQ POST HEADER Source: Samtec TSW.pdf; MF: Samtec Inc.; MPN: TSW-105-07-G-D
Y1 = XT9S20ANA12M:XT9S20ANA12M: Crystals 12MHz 20pF Source: Datasheet; DESCRIPTION: Crystals 12MHz 20pF; HEIGHT: 3.5mm; MANUFACTURER_NAME: Vishay; MANUFACTURER_PART_NUMBER: XT9S20ANA12M; MOUSER_PART_NUMBER: 73-XT49S1200-20; MOUSER_PRICE-STOCK: https://www.mouser.co.uk/ProductDetail/Vishay-Dale/XT9S20ANA12M?qs=dEWVFCiHFQU3RvQOkgKjqw%3D%3D
Z1 = UDZLVTE-17150:UDZLVTE-17150: ROHM - UDZLVTE-17150 - Zener Single Diode, 150 V, 200 mW, SOD-323FL, 2 Pins, 150 C Source: Datasheet <https://componentsearchengine.com/Datasheets/2/UDZLVTE-17150.pdf>; DESCRIPTION: ROHM - UDZLVTE-17150 - Zener Single Diode, 150 V, 200 mW, SOD-323FL, 2 Pins, 150 C; HEIGHT: 0.9mm; MANUFACTURER_NAME: ROHM Semiconductor; MANUFACTURER_PART_NUMBER: UDZLVTE-17150; MOUSER_PART_NUMBER: 755-UDZLVTE-17150; MOUSER_PRICE-STOCK: https://www.mouser.co.uk/ProductDetail/ROHM-Semiconductor/UDZLVTE-17150/?qs=uPV7ZbtEjc5dJhqDrwh%252BYA%3D%3D
Z2-Z8 = BZX84C3V3-7-F:BZX84C3V3-7-F: Zener Diodes 300mW 3.3V Zener AEC-Q101 Qualified Source: Datasheet <https://datasheet.datasheetarchive.com/originals/dk/DKDS-29/577741.pdf>; DESCRIPTION: Zener Diodes 300mW 3.3V Zener AEC-Q101 Qualified; HEIGHT: 1.2mm; MANUFACTURER_NAME: Diodes Inc.; MANUFACTURER_PART_NUMBER: BZX84C3V3-7-F; MOUSER_PART_NUMBER: 621-BZX84C3V3-F; MOUSER_PRICE-STOCK: https://www.mouser.co.uk/ProductDetail/Diodes-Incorporated/BZX84C3V3-7-F?qs=mdgdZEim3xD%252BgHGo8QKO%2Fg%3D%3D

## Board
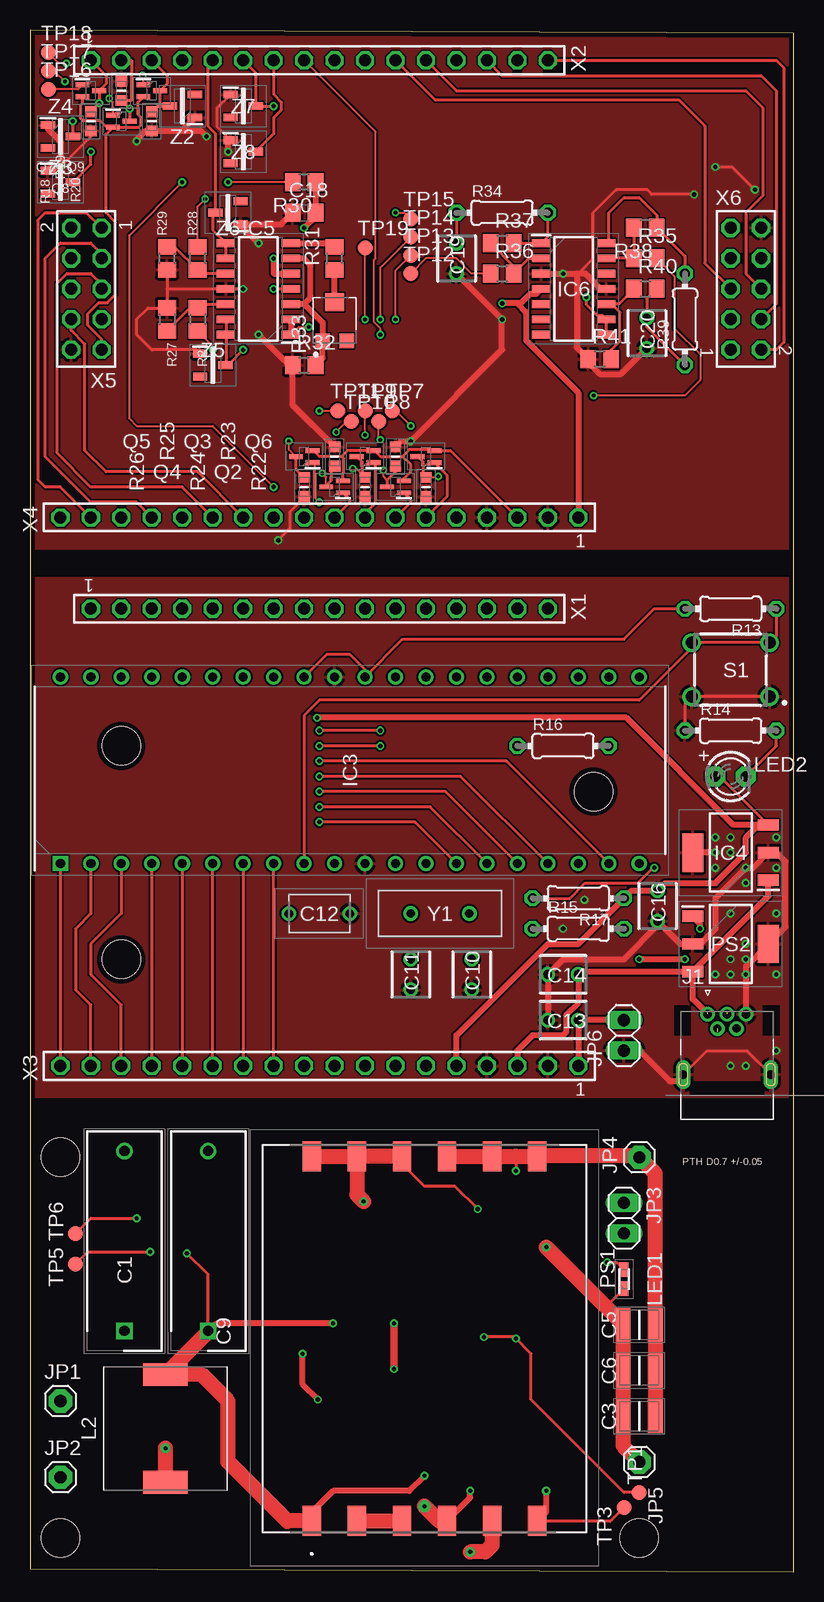
[diagram p1: board, top side]
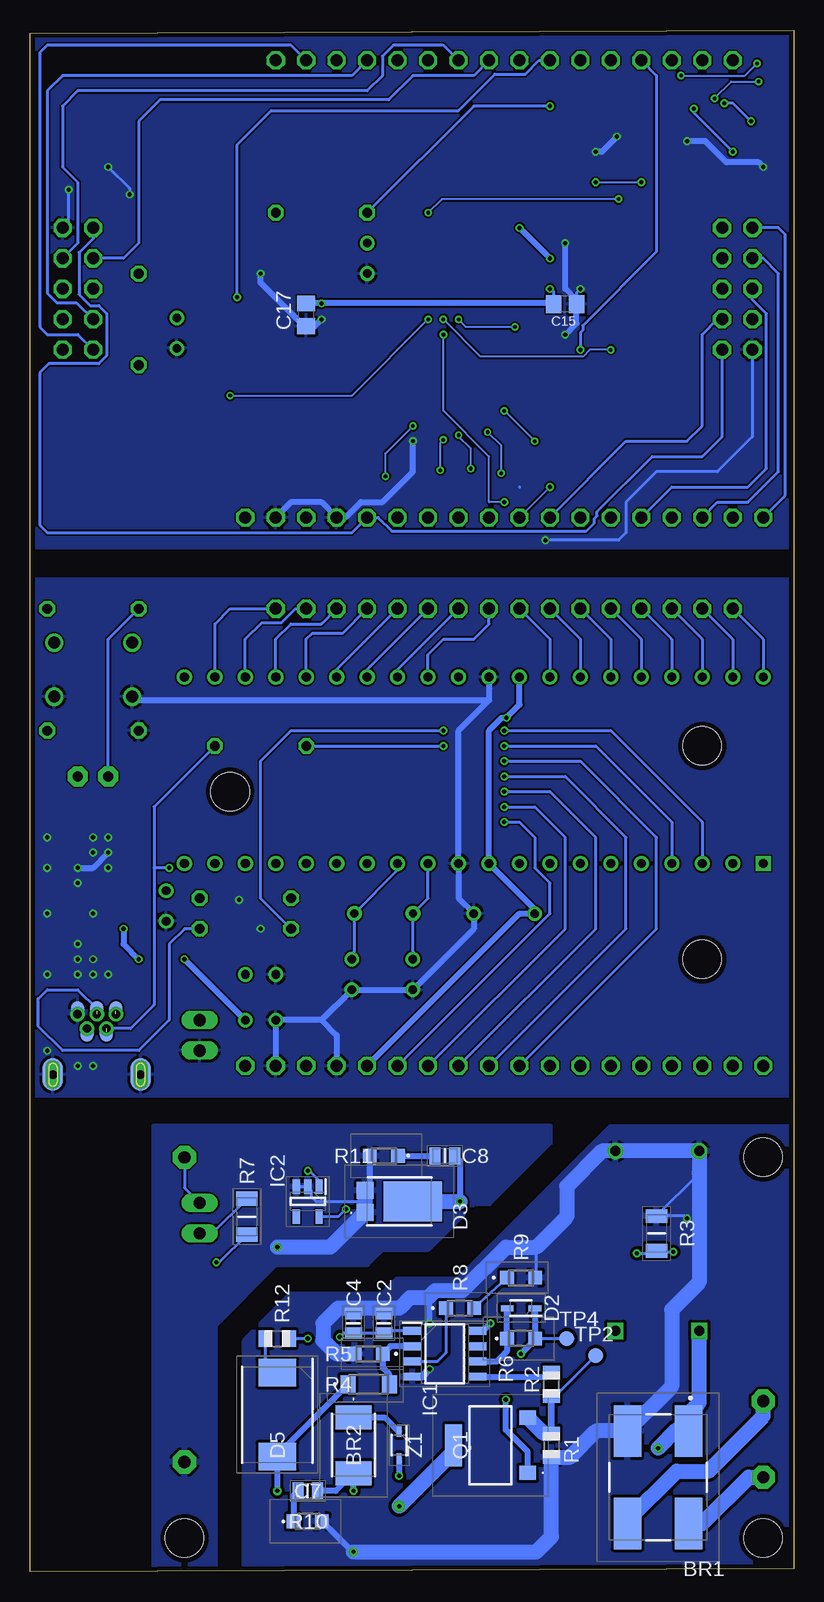
[diagram p2: board, bottom side, seen from below]

Size 63.68 x 128.51 mm. Coordinates in mm from the lower left corner, seen from the top.
Outline: 0,39.62 0,37.08
Outline: 0,85.34 0,84.07
Outline: 0,0.25 63.68,0 63.68,128.26 0,128.51 0,0.25
Copper layers (1*16): Top 0.035mm / dielectric 1.5mm / Bottom 0.035mm
Design rules "NOA Eagle Rule 2016-06-12 *": minimum track width 6mil, minimum drill 0.3mm, track to track 6mil, track to pad 6mil, pad to pad 6mil, via to via 6mil, smd to smd 0mil, copper to edge 0.4mm, drill to drill 10mil, minimum pad ring 10mil, minimum via ring 6mil, stop-mask expansion 2mil, vias tented up to drill 25mil, thermal gap 10mil
Holes 3.2 mm at 2.54,34.54 50.8,2.79 2.54,2.79 46.99,65.02 7.62,68.83 7.62,51.05

### Footprints (pad centres in the part's own frame; a part is rotated, then mirrored left to right if it is on the bottom)
CDDF406SL = smd 2.3 x 4.3: 1 2.55,3.85; 2 2.55,-3.85; 3 -2.55,-3.85; 4 -2.55,3.85
CD214BFS2K = smd 2 x 3: 1 -2.325,0; 2 2.325,0
HDRV2W65P0X1500_1X2_1790X585X1 = drill 0.85 pad 1.275 square: 1 0,0 | drill 0.85 pad 1.275: 2 15,0
CAPC2012X95N = smd 0.94 x 1.43: 1 -0.82,0; 2 0.82,0
CAPC3225X270N = smd 1.22 x 2.72: 1 -1.35,0; 2 1.35,0
C315 = drill 0.71 pad 1.21: 1 -1.27,0; 2 1.27,0
1C20C0G220J050B = drill 0.708 pad 1.214: 1 0,0; 2 5.08,0
C0805 = smd 1.3 x 1.5: 1 -0.95,0; 2 0.95,0
SOD2513X115N = smd 1.075 x 0.5: 1 -1.15,0; 2 1.15,0
MBR5U100TP = smd 1.4 x 1.4: 1 -2.855,-0.92; 2 -2.855,0.92 | smd 4.86 x 3.36: 3 1.125,0
DIOM8059X290N = smd 2.3 x 3.15: 1 -3.5,0; 2 3.5,0
SOIC127P600X175-8N = smd 1.528 x 0.65: 1 -2.711,1.905; 2 -2.711,0.635; 3 -2.711,-0.635; 4 -2.711,-1.905; 5 2.711,-1.905; 6 2.711,-0.635; 7 2.711,0.635; 8 2.711,1.905
SOT95P280X145-5N = smd 1.2 x 0.6: 1 -1.25,0.95; 2 -1.25,0; 3 -1.25,-0.95; 4 1.25,-0.95; 5 1.25,0.95
DIP1556W56P254L5232H483Q40N = drill 0.759 pad 1.159 square: 1 -7.779,24.13 | drill 0.759 pad 1.159: 2 -7.779,21.59; 3 -7.779,19.05; 4 -7.779,16.51; 5 -7.779,13.97; 6 -7.779,11.43; 7 -7.779,8.89; 8 -7.779,6.35; 9 -7.779,3.81; 10 -7.779,1.27; 11 -7.779,-1.27; 12 -7.779,-3.81; 13 -7.779,-6.35; 14 -7.779,-8.89; 15 -7.779,-11.43; 16 -7.779,-13.97; 17 -7.779,-16.51; 18 -7.779,-19.05; 19 -7.779,-21.59; 20 -7.779,-24.13; 21 7.779,-24.13; 22 7.779,-21.59; 23 7.779,-19.05; 24 7.779,-16.51; 25 7.779,-13.97; 26 7.779,-11.43; 27 7.779,-8.89; 28 7.779,-6.35; 29 7.779,-3.81; 30 7.779,-1.27; 31 7.779,1.27; 32 7.779,3.81; 33 7.779,6.35; 34 7.779,8.89; 35 7.779,11.43; 36 7.779,13.97; 37 7.779,16.51; 38 7.779,19.05; 39 7.779,21.59; 40 7.779,24.13
SOT230P700X180-4N = smd 1.75 x 0.95: 1 -3.15,2.3; 2 -3.15,0; 3 -3.15,-2.3 | smd 1.75 x 3.2: 4 3.15,0
SOIC127P600X175-14N = smd 1.525 x 0.65: 1 -2.712,3.81; 2 -2.712,2.54; 3 -2.712,1.27; 4 -2.712,0; 5 -2.712,-1.27; 6 -2.712,-2.54; 7 -2.712,-3.81; 8 2.712,-3.81; 9 2.712,-2.54; 10 2.712,-1.27; 11 2.712,0; 12 2.712,1.27; 13 2.712,2.54; 14 2.712,3.81
MOLEX_54819-0519 = smd 1.1 x 1.65 bottom: 1 0,0.275; 2 0.8,-1.475; 3 1.6,0.275; 4 2.4,-1.475; 5 3.2,0.275 | drill 0.7 pad 1.05: 6 0,0; 7 0.8,-1.2; 8 1.6,0; 9 2.4,-1.2; 10 3.2,0 | drill 0.7 pad 1.123 long: 11 -2.05,-5.05; 12 5.25,-5.05 | smd 1.7 x 2.7 bottom: S1 -2.05,-5.05; S2 5.25,-5.05
1X01 = drill 1.016 pad 1.93 octagon: 1 0,0
1X02 = drill 1.016 long: 1 -1.27,0; 2 1.27,0
INDDFN1000X1000X480-2N = smd 1.91 x 3.7: 1 -4.495,0; 2 4.495,0
LEDM168X80N = smd 1.2 x 0.75: 1 -0.8,0; 2 0.8,0
LED3MM = drill 0.813 pad 1.676 octagon: A -1.27,0; K 1.27,0
750311771 = smd 2.5 x 1.52: 1 -15.19,9.4; 2 -15.19,5.64; 3 -15.19,1.88; 4 -15.19,-1.88; 5 -15.19,-5.64; 6 -15.19,-9.4; 7 15.19,-9.4; 8 15.19,-5.64; 9 15.19,-1.88; 10 15.19,1.88; 11 15.19,5.64; 12 15.19,9.4
IPN70R1K2P7SATMA1 = smd 1.2 x 1.4: 1 -2.3,-3.1; 3 2.3,-3.1 | smd 3.5 x 1.4: 2 0,3.1
SOT50P160X90-3N = smd 1.15 x 0.4: 1 -0.7,0.5; 2 -0.7,-0.5; 3 0.7,0
R0805 = smd 1.1 x 1.4: 1 -1,0; 2 1,0
RESC3216X74N = smd 1.15 x 1.8: 1 -1.45,0; 2 1.45,0
ERA8A_(0805) = smd 1.25 x 1.5: 1 -1.725,0; 2 1.725,0
ERA6A_(0805) = smd 1.15 x 1.15: 1 -1.175,0; 2 1.175,0
ERA6VK = smd 1.15 x 1.15: 1 -1.175,0; 2 1.175,0
RESC3216X75N = smd 1.2 x 1.8: 1 -1.5,0; 2 1.5,0
0204/7 = drill 0.813 octagon: 1 -3.81,0; 2 3.81,0
RESC1608X55N = smd 0.9 x 0.95: 1 -0.8,0; 2 0.8,0
R0805' = smd 1.3 x 1.5: 1 -0.95,0; 2 0.95,0
TRIM_TC33X-2-102E = smd 1.2 x 1.2: 1 -1.8,1; 3 -1.8,-1 | smd 1.5 x 1.6: 2 1.45,0
FSM4JH = drill 1 pad 1.5: 1 -3.25,2.25; 2 3.25,2.25; 3 -3.25,-2.25; 4 3.25,-2.25
B1,27 = smd 1.27 x 1.27: TP 0,0
TSW-116-XX-G-S = drill 1 pad 1.5 octagon: 1 19.05,0; 2 16.51,0; 3 13.97,0; 4 11.43,0; 5 8.89,0; 6 6.35,0; 7 3.81,0; 8 1.27,0; 9 -1.27,0; 10 -3.81,0; 11 -6.35,0; 12 -8.89,0; 13 -11.43,0; 14 -13.97,0; 15 -16.51,0; 16 -19.05,0
TSW-118-XX-G-S = drill 1 pad 1.5 octagon: 1 21.59,0; 2 19.05,0; 3 16.51,0; 4 13.97,0; 5 11.43,0; 6 8.89,0; 7 6.35,0; 8 3.81,0; 9 1.27,0; 10 -1.27,0; 11 -3.81,0; 12 -6.35,0; 13 -8.89,0; 14 -11.43,0; 15 -13.97,0; 16 -16.51,0; 17 -19.05,0; 18 -21.59,0
TSW-105-XX-G-D = drill 1 pad 1.5 octagon: 1 5.08,-1.27; 2 5.08,1.27; 3 2.54,-1.27; 4 2.54,1.27; 5 0,-1.27; 6 0,1.27; 7 -2.54,-1.27; 8 -2.54,1.27; 9 -5.08,-1.27; 10 -5.08,1.27
XT9S20ANA12M = drill 0.68 pad 1.247: 1 0,0; 2 4.88,0
SODFL2512X90N = smd 0.87 x 0.42: 1 -1.125,0; 2 1.125,0
SOT96P240X120-3N = smd 1.2 x 0.65: 1 -1.05,0.96; 2 -1.05,-0.96; 3 1.05,0

### Placement (x,y rotation side)
BR1  11.3,7.87 0 bottom
BR2  36.7,10.54 270 bottom
C1  7.87,20.07 90 top
C2  34.16,20.7 90 bottom
C3  50.8,12.95 180 top
C4  36.7,20.7 90 bottom
C5  50.8,20.57 180 top
C6  50.8,16.76 180 top
C7  40.51,6.73 180 bottom
C8  29.08,34.67 180 bottom
C9  14.86,20.07 90 top
C10  36.83,49.78 270 top
C11  31.75,49.78 270 top
C12  21.59,54.86 0 top
C13  44.45,45.97 180 top
C14  44.45,49.78 180 top
C15  19.05,105.66 180 bottom
C16  52.32,55.5 270 top
C17  40.64,104.78 90 bottom
C18  22.86,113.28 0 top
C19  35.56,109.47 270 top
C20  51.44,103.25 270 top
D2  22.73,21.97 180 bottom
D3  32.89,30.86 0 bottom
D5  43.05,13.08 270 bottom
IC1  29.08,18.16 0 bottom
IC2  40.51,30.86 270 bottom
IC3  26.67,66.8 90 top
IC4  58.42,59.94 180 top
IC5  19.05,106.93 180 top
IC6  45.34,106.93 0 top
J1  56.52,46.48 0 top
JP1  2.54,14.22 0 top
JP2  2.54,7.87 0 top
JP3  49.53,29.46 270 top
JP4  50.8,34.54 0 top
JP5  50.8,9.14 0 top
JP6  49.53,44.7 90 top
L2  11.3,11.94 90 top
LED1  49.53,24.38 90 top
LED2  58.42,66.29 0 top
PS1  32.89,19.43 90 top
PS2  58.42,52.32 0 top
Q1  25.27,10.54 90 bottom
Q2  30.48,90.42 180 top
Q3  27.94,92.96 180 top
Q4  25.4,90.42 180 top
Q5  22.86,92.96 180 top
Q6  33.02,92.96 180 top
Q7  5.08,123.44 0 top
Q8  7.62,120.9 0 top
Q9  10.16,123.44 0 top
R1  20.19,10.54 270 bottom
R2  20.19,15.62 90 bottom
R3  11.43,28.19 90 bottom
R4  35.43,15.62 0 bottom
R5  35.43,18.16 180 bottom
R6  22.73,19.43 0 bottom
R7  45.59,29.59 90 bottom
R8  27.81,21.97 0 bottom
R9  22.73,24.51 0 bottom
R10  40.51,4.19 0 bottom
R11  34.16,34.67 180 bottom
R12  43.05,19.43 0 bottom
R13  58.42,80.26 180 top
R14  58.42,70.1 0 top
R15  45.72,53.59 0 top
R16  44.45,68.83 0 top
R17  45.72,56.13 180 top
R18  5.08,120.9 90 top
R19  7.62,123.44 270 top
R20  10.16,120.9 90 top
R21  [R0805']  13.97,104.39 270 top
R22  33.02,90.42 90 top
R23  30.48,92.96 270 top
R24  27.94,90.42 90 top
R25  25.4,92.96 270 top
R26  22.86,90.42 90 top
R27  [R0805']  11.43,104.39 270 top
R28  [R0805']  13.97,109.47 90 top
R29  [R0805']  11.43,109.47 90 top
R30  [R0805']  22.86,115.82 180 top
R31  [R0805']  25.4,109.47 90 top
R32  [R0805']  22.86,100.58 0 top
R33  25.4,104.39 90 top
R34  39.37,113.28 0 top
R35  [R0805']  51.31,109.47 0 top
R36  [R0805']  39.37,108.2 0 top
R37  [R0805']  39.37,110.74 0 top
R38  [R0805']  51.31,112.01 180 top
R39  54.61,104.39 90 top
R40  [R0805']  51.31,106.93 0 top
R41  [R0805']  47.5,101.09 0 top
S1  58.42,75.18 180 top
TP1  50.8,6.6 0 top
TP2  16.51,18.03 0 bottom
TP3  49.53,5.33 0 top
TP4  18.92,19.43 0 bottom
TP5  3.81,25.65 0 top
TP6  3.81,28.19 0 top
TP7  30.23,96.77 0 top
TP8  29.08,95.89 0 top
TP9  27.94,96.77 0 top
TP10  26.8,95.89 0 top
TP11  25.65,96.77 0 top
TP12  31.75,108.2 0 top
TP13  31.75,109.73 0 top
TP14  31.75,111.25 0 top
TP15  31.75,112.78 0 top
TP16  1.52,123.57 0 top
TP17  1.52,125.09 0 top
TP18  1.52,126.62 0 top
TP19  27.94,110.36 0 top
X1  24.13,80.26 180 top
X2  24.13,125.98 180 top
X3  24.13,42.16 0 top
X4  24.13,87.88 0 top
X5  4.7,106.93 90 top
X6  59.69,106.93 270 top
Y1  31.75,54.86 0 top
Z1  32.89,10.54 270 bottom
Z2  12.7,122.17 180 top
Z3  2.54,115.82 0 top
Z4  2.54,119.63 0 top
Z5  15.24,100.58 0 top
Z6  16.51,113.28 180 top
Z7  17.78,122.17 0 top
Z8  17.78,118.36 0 top

### Tracks (layer width: path | path; a pad name or v marks a point on that pad's centre or on a via)
1_1  (via drill 0.3 pad 0.55)
  Top 0.152: IC5.1 22.4,103.76 v23.24,103.76 | v27.94,104.39 TP19.TP
  Top 0.508: IC5.2 IC5.1
  Bottom 0.152: v23.24,103.76 27.3,103.76 v27.94,104.39
2_1
  Top 0.152: R36.1 36.83,108.2 35.56,109.47 33.02,109.47 TP12.TP
2_2  (via drill 0.3 pad 0.55)
  Top 0.152: R35.2 53.72,108.01 53.72,103.63 55.88,101.47 55.88,99.31 54.61,98.04 v46.99,98.04 | v30.48,104.39 30.48,108.46 TP13.TP
  Bottom 0.152: v46.99,98.04 36.83,98.04 v30.48,104.39
2_3  (via drill 0.3 pad 0.55)
  Top 0.152: R21.2 15.24,102.17 v15.24,101.85 | v29.21,104.39 29.21,108.71 TP14.TP
  Bottom 0.152: v15.24,101.85 16.99,101.85 17.55,101.3 26.11,101.3 v29.21,104.39
2_4  (via drill 0.3 pad 0.55)
  Top 0.152: R28.2 13.97,113.79 v14.61,114.43 | v30.48,113.28 31.24,113.28 TP15.TP
  Bottom 0.152: v14.61,114.43 29.34,114.43 v30.48,113.28
3_1  (via drill 0.3 pad 0.55)
  Top 0.152: R22.2 33.95,91.22 v34.04,91.31 | v31.75,95.5 30.48,96.77 TP7.TP
  Top 0.254: Q6.3 32.77,92.52 32.77,91.48 R22.2
  Bottom 0.152: v34.04,91.31 34.04,93.22 v31.75,95.5
3_2  (via drill 0.3 pad 0.55)
  Top 0.152: 29.78,90.99 29.46,91.31 v29.46,91.82 | v29.21,94.36 29.08,94.49 TP8.TP
  Top 0.254: R23.2 30.48,91.69 29.78,90.99 Q2.3
  Bottom 0.152: v29.46,91.82 29.46,94.11 v29.21,94.36
3_3  (via drill 0.3 pad 0.55)
  Top 0.152: R24.2 27.22,91.95 v26.92,91.95 | v27.94,94.74 TP9.TP
  Top 0.254: Q3.3 27.68,92.52 27.68,92.16 27.69,92.16 27.69,91.48 R24.2
  Bottom 0.152: v26.92,91.95 26.92,93.6 27.94,94.62 v27.94,94.74
3_4  (via drill 0.3 pad 0.55)
  Top 0.152: Q4.3 24.7,91.25 v24.38,91.57 | v25.53,95 26.42,95.89 TP10.TP
  Top 0.254: Q4.3 24.7,90.55 25.14,91 25.14,91.91 R25.2
  Bottom 0.152: v24.38,91.57 24.38,93.85 v25.53,95
3_5  (via drill 0.3 pad 0.55)
  Top 0.152: Q5.3 21.59,93.53 v21.59,94.23 | v24.13,96.77 TP11.TP
  Top 0.254: R26.2 22.16,91.92 Q5.3
  Bottom 0.152: v21.59,94.23 v24.13,96.77
3V3  (via drill 0.35)
  Top 0.254: R13.2 52.07,80.26 49.53,77.72 31.08,77.72 IC3.30 27.94,75.18 26.67,76.45 24.73,76.45 IC3.32 | LED2.A 57.52,66.29 IC4.3
  Top 0.508: X3.5 35.56,44.7 43.18,52.32 45.72,52.32 R17.1 50.16,56.77 C16.1 52.96,57.4 57.15,57.4 59.69,59.94 59.69,61.21 60.72,62.24 IC4.3 58.66,62.24 49.72,71.19 v23.94,71.19
  Bottom 0.254: LED2.A 57.15,77.72 R13.2
  Bottom 0.508: IC3.32 22.86,72.27 v23.94,71.19 24.32,71.19 25.4,70.11 IC3.10 21.59,55.21 C12.1 22.86,54.86 X3.5
3V3_2
  Top 0.254: X5.9 5.97,102.76 4.82,103.92 4.82,104.87 5.72,105.78 6.45,105.78 7.12,106.46 7.12,112.49 6.35,113.27 6.35,119.83 Q8.2 | Q8.2 9.08,120.4 9.28,120.6 9.28,121.21 9.02,121.47 9.02,122.5 Q9.2 | Q8.2 6.41,120.4 5.87,120.95 4.42,120.95 4.22,121.15 4.22,122.26 4.38,122.42 Q7.2
  Bottom 0.254: X6.9 58.42,111.11 59.57,109.95 59.57,106.46 58.67,105.55 57.94,105.55 57.27,104.87 57.27,101.38 57.94,100.7 62.11,100.7 62.87,99.95 62.87,87.25 62.23,86.61 36.83,86.61 X4.5 34.65,87.88 33.5,86.73 17.3,86.73 16.63,87.41 16.63,87.77 16.39,88 16.39,88.36 11.79,92.96 7.62,92.96 5.97,94.62 X5.9
4_1
  Top 0.152: Q7.1 4.01,123.57 TP16.TP
4_2  (via drill 0.3 pad 0.55)
  Top 0.152: Q8.1 6.92,122.1 6.92,122.5 v6.6,122.81 | v2.92,124.21 2.03,125.09 TP17.TP
  Bottom 0.152: v6.6,122.81 5.21,124.21 v2.92,124.21
4_3  (via drill 0.3 pad 0.55)
  Top 0.152: Q9.1 9.46,124.65 v9.4,124.71 | v3.05,125.73 2.41,125.73 TP18.TP
  Bottom 0.152: v9.4,124.71 4.06,124.71 v3.05,125.73
5V  (1 unrouted)
  Top 0.508: J1.6 55.27,47.73 PS2.3 | PS2.3 61.57,56.32 IC4.1 | PS2.3 45.96,50.02 C14.1 45.72,47.42 44.7,46.4 44.7,44.95 44.45,44.7 41.91,44.7 40.64,43.43 X3.3
5V_2
  Top 0.254: Q5.2 23.63,93.46 24.13,92.96 25.98,92.96 | 31.06,92.96 29.21,92.96 28.71,93.46 Q3.2 26.48,93.46 25.98,92.96 | 31.06,92.96 31.64,93.55 33.64,93.55 Q6.2 35.06,93.46 X4.3 | Q2.2 31.18,91.12 31.75,91.69 31.75,92.27 31.06,92.96 | Q4.2 26.1,91.54 26.15,91.6 26.15,92.79 25.98,92.96
15V  (via drill 0.35)
  Top 0.508: PS2.1 55.27,54.57 55.88,53.96 v55.88,53.59 | v54.61,51.05 v50.8,51.05 | X3.1 C13.1 JP6.2
  Bottom 0.508: v55.88,53.59 55.88,52.32 v54.61,51.05 | v50.8,51.05 C13.1
15V_2  (via drill 0.35)
  Top 0.254: v20.32,106.93 IC5.4
  Top 0.508: IC6.4 42.19,106.5 41.71,106.5 40.94,105.73 C17.2 | C17.2 v39.37,105.73 | C17.2 41.36,105.01 41.36,102.64 45.72,98.28 X4.1
  Bottom 0.254: C15.2 20,106.74 20.19,106.93 v20.32,106.93
  Bottom 0.508: C15.2 20.06,105.73 v39.37,105.73 C17.2
AUX  (via drill 0.35 pad 0.7)
  Top 0.254: TP3.TP 48.39,4.19 42.34,4.19 PS1.6
  Top 0.508: PS1.6 43.05,5 v43.05,6.73
  Bottom 0.508: R4.1 43.05,9.73 D5.2 v43.05,6.73
C0
  Top 0.254: X2.16 62.23,125.98 62.87,125.35 62.87,102.49 62.23,101.85 X6.2
C1
  Bottom 0.254: X2.15 41.91,127.25 62.23,127.25 62.87,126.62 62.87,103.76 62.23,103.12 59.69,103.12 X6.1
C2
  Top 0.254: X2.14 39.37,124.71 60.96,124.71 62.23,123.44 62.23,105.66 X6.4
C3
  Bottom 0.254: X2.13 36.83,124.71 60.96,124.71 62.23,123.44 62.23,106.57 61.44,105.78 59.81,105.78 X6.3
C4
  Top 0.254: X2.12 35.56,123.44 59.69,123.44 61.09,122.05 61.09,114.68 59.69,113.28 59.69,108.2 X6.6
C5
  Top 0.254: X2.11 33.78,122.68 54.1,122.68 56.26,120.52 56.26,109.09 X6.5
C6
  Bottom 0.254: X2.10 29.21,127.25 33.38,127.25 34.29,126.35 34.29,124.71 35.56,123.44 59.69,123.44 60.96,122.17 60.96,117.09 59.69,115.82 59.69,110.74 X6.8
C7
  Bottom 0.254: X2.9 26.67,124.71 31.75,124.71 33.78,122.68 52.83,122.68 54.61,120.9 54.61,110.74 55.88,109.47 X6.7
D0
  Bottom 0.254: X4.18 0.71,89.72 0.71,111.45 1.27,112.01 X5.2
D1
  Top 0.254: X4.17 2.54,90.42 1.27,90.42 0.71,90.99 0.71,112.72 1.27,113.28 4.7,113.28 X5.1
D2
  Bottom 0.254: X4.16 6.35,89.15 3.81,89.15 1.27,91.69 1.27,108.2 2.54,109.47 X5.4
D3
  Top 0.254: X4.15 8.89,89.15 5.08,89.15 1.27,92.96 1.27,109.47 2.54,110.74 5.08,110.74 5.97,109.86 X5.3
D4
  Bottom 0.254: X4.14 10.16,90.42 3.81,90.42 2.27,91.96 2.27,104.87 3.43,106.03 X5.6
D5
  Top 0.254: X4.13 12.7,90.42 5.08,90.42 2.27,93.23 2.27,107.41 3.07,108.2 5.08,108.2 5.97,107.32 X5.5
D6
  Top 0.254: X4.12 13.97,91.69 6.35,91.69 4.58,93.46 4.58,102.33 3.43,103.49 X5.8
D7
  Bottom 0.254: X5.7 6.35,104.39 7.62,103.12 7.62,95.5 8.89,94.23 13.97,94.23 X4.11
DRV  (via drill 0.35)
  Top 0.508: v24,14.35 22.73,15.62 v22.73,18.16
  Bottom 0.254: R6.2 TP4.TP
  Bottom 0.508: D2.1 21.56,21.95 R6.2 21.56,19.34 v22.73,18.16 | Q1.1 22.17,9.98 24,11.81 v24,14.35
GND  (via drill 0.35, 0.35 pad 0.8)
  Top 0.254: TP6.TP 5.08,29.46 v8.89,29.46
  Top 0.61: v30.35,16.89 v30.35,20.7
  Top 1.27: PS1.5 38.53,2.21 37.97,1.65 v36.7,1.65
  Bottom 0.254: R9.2 21.46,24.61 21.46,27.05 | 7.87,33.27 7.87,33.2 R3.2 9.07,29.64 v8.89,29.46
  Bottom 0.508: v30.35,20.7 30.35,22.57 30.64,22.86 | R10.2 36.8,1.65 v36.7,1.65
  Bottom 0.61: IC1.4 30.99,16.26 v30.35,16.89
  Bottom 1.27: R5.2 38.14,18.16 39.24,19.27 39.24,20.7 37.97,21.97 32.88,21.97 31.99,22.86 30.64,22.86 30.45,22.86 29.88,23.44 27.62,23.44 24,27.05 21.46,27.05 18.92,29.59 18.92,32.13 15.99,35.07 C9.2 C1.2 7.87,33.27 7.87,24.13 10.16,21.84 10.16,15.42 BR1.4 16.47,11.72 18.65,9.54 R1.2 20.19,2.92 21.46,1.65 v36.7,1.65
  pour Bottom (isolate 0.254): -20.34,0.22 45.72,0.22 45.72,19.3 41.91,23.11 34.29,23.11 33.02,24.38 27.94,24.38 15.24,37.08 0,37.08
GND1  (via drill 0.35)
  Top 0.254: S1.1 S1.2 54.61,72.37 R14.1 | J1.S2 59.82,43.38 56.41,43.38 J1.11
  Top 0.508: C13.2 C14.2 44.45,51.05 49.53,51.05 52.32,53.85 C16.2 54.23,52.32 PS2.2 55.88,52.32 57.15,53.59 57.15,56.13 v59.69,58.67 60.3,58.67 IC4.2 62.23,59.94 62.99,59.18 62.99,53.75 PS2.4 59.72,50.47 J1.10 | v57.15,59.94 IC4.4 | JP6.1 50.8,43.43 53.34,40.89 53.93,40.89 J1.11
  Bottom 0.508: IC3.31 25.4,72.64 | 25.4,72.64 27.94,70.1 IC3.11 27.94,56.13 C12.2 26.67,53.59 C11.2 C10.2 39.37,45.97 | 39.37,45.97 C13.2 X3.2 | S1.2 54.88,72.64 25.4,72.64 | v59.69,58.67 58.42,58.67 v57.15,59.94 | 39.37,45.97 38.1,44.7 X3.4
  other vias: 46.23,56.01 44.45,53.59 57.15,61.21 58.42,61.21 62.23,61.21 62.23,58.67 58.42,59.94 57.15,58.67 59.69,57.4 62.23,54.86 58.42,54.86 59.69,52.32 59.69,51.05 62.23,49.78 58.42,51.05 59.69,49.78 58.42,49.78 57.15,49.78 62.23,43.43 59.69,42.16 58.42,42.16
  pour Bottom: -2.54,82.8 -2.54,39.62 64.77,39.62 64.77,82.8
  pour Top: -1.27,82.8 -1.27,39.62 63.63,39.62 63.63,82.8
GND_2  (via drill 0.35)
  Top 0.254: v20.7,85.98 21.71,86.98 21.71,88.36 22.86,89.52 R26.1 | v17.78,106.93 IC5.11 11.43,106.93 | R29.1 11.43,106.93 | 11.43,106.93 R27.1 9.84,105.34 8.89,104.39 8.89,103.12 10.16,101.85 13.88,101.85 Z5.1 | v60.45,115.19 58.55,117.09 v57.15,117.09 | 45.72,108.2 46.91,109.39 46.91,113.23 48.86,115.19 51.47,115.19 51.85,114.81 v55.37,114.81 | Z7.1 15.57,121.97 15.57,120.48 Z8.1 | v2.54,117.09 5.08,119.63 R18.1
  Top 0.508: R25.1 21.91,97.25 R32.1 21.59,100.58 v19.05,103.12 | v19.05,110.74 17.56,112.23 Z6.1 20.95,112.32 C18.1 | Z3.1 1.8,117.09 v2.54,117.09 2.47,117.16 2.6,117.29 2.6,119.16 1.49,120.27 Z4.1 | v8.89,119.25 8.89,119.37 9.63,120.1 R20.1 12.64,120.1 | 12.64,120.1 Z2.1 | C19.2 v39.37,104.39 39.37,101.85 v31.75,94.23 30.95,94.23 R23.1 | IC6.11 47.57,106.93 46.3,108.2 45.72,108.2 45.59,108.2 | IC6.3 v44.45,108.2 45.59,108.2 | 45.59,108.2 45.59,102.05 R41.1 46.55,100.8 47.51,99.83 49.29,99.83 C20.2 | 12.64,120.1 14.26,120.1 v14.73,119.63 | v16.51,118.36 16.51,119.1 Z8.1
  Bottom 0.254: X5.10 3.43,94.62 6.35,91.69 11.43,91.69 13.97,89.15 13.97,86.61 14.61,85.98 v20.7,85.98 | v17.78,106.93 18.1,106.61 C15.1 | 22.86,90.42 22.86,90.4 | 33.02,90.4 33.02,90.42 | X6.10 60.45,112.52 v60.45,115.19 | v57.15,117.09 55.37,115.32 v55.37,114.81
  Bottom 0.508: v31.75,94.23 31.75,91.69 33.02,90.42 34.28,89.17 36.09,89.17 37.37,87.88 X4.4 39.37,89.15 41.91,89.15 X4.2 | v19.05,103.12 18.1,104.07 C15.1 18.1,105.98 19.05,106.93 v19.05,110.74 | v8.89,119.25 7.37,119.25 5.6,117.48 2.92,117.48 v2.54,117.09 | v39.37,104.39 39.94,103.83 C17.1 40.81,103.83 44.45,107.47 v44.45,108.2 | v14.73,119.63 16,118.36 v16.51,118.36
  pour Top: -1.27,128.52 -1.27,85.34 64.77,85.34 64.77,128.52
  pour Bottom: -1.27,128.52 -1.27,85.34 64.64,85.34 64.64,128.52
L
  Bottom 1.27: BR1.3 13.85,4.28 9.75,8.38 7.11,8.38 2.54,12.95 JP1.1
N
  Bottom 1.27: BR1.2 7.61,4.02 3.76,7.87 JP2.1
N$1
  Bottom 0.508: IC1.5 20.56,16.26 R2.2
N$2
  Bottom 0.508: C7.2 41.69,6.38 R10.1
N$3
  Bottom 0.508: R11.1 C8.2
N$4
  Bottom 0.254: D5.1 44.05,17.58 R12.1
N$5
  Top 1.27: PS1.2 PS1.3
N$6
  Bottom 0.508: BR2.1 34.09,12.87 Z1.1
N$7
  Bottom 0.508: D2.2 23.91,21.95 R6.1 23.91,18.36 24.74,17.53 IC1.6
N$8
  Bottom 0.254: R8.2 26.64,21.99 R9.1
N$9  (via drill 0.35)
  Top 0.254: v48.13,25.78 48.93,25.78 LED1.2
  Bottom 0.254: R7.1 47.9,25.78 v48.13,25.78
N$10
  Bottom 0.254: R8.1 28.99,18.26 29.72,17.53 IC1.3
N$11
  Bottom 0.254: JP3.2 48.49,28.19 R7.2
N$12
  Bottom 0.254: X1.1 2.54,77.72 IC3.40
N$13
  Bottom 0.254: X1.2 5.08,77.72 IC3.39
N$14
  Bottom 0.254: X1.3 7.62,77.72 IC3.38
N$15
  Bottom 0.254: X1.4 10.16,77.72 IC3.37
N$16
  Bottom 0.254: X1.5 12.7,77.72 IC3.36
N$17
  Bottom 0.254: X1.6 15.24,77.72 IC3.35
N$18
  Bottom 0.254: X1.7 17.78,77.72 IC3.34
N$19
  Bottom 0.254: X1.8 20.32,77.72 IC3.33
N$20
  Bottom 0.254: IC3.22 48.26,78.99 46.99,80.26 X1.16
N$21
  Bottom 0.254: IC3.23 45.72,77.72 44.33,79.11 42.7,79.11 41.55,80.26 X1.15
N$22
  Bottom 0.254: IC3.24 43.18,77.72 41.91,78.99 39.37,78.99 X1.14
N$23
  Bottom 0.254: IC3.25 40.64,77.72 40.13,78.23 37.59,78.23 X1.13
N$24
  Bottom 0.254: IC3.26 38.1,75.18 X1.12
N$25
  Bottom 0.254: IC3.27 35.56,75.18 X1.11
N$26
  Bottom 0.254: IC3.28 33.02,75.18 X1.10
N$27
  Bottom 0.254: IC3.29 30.48,76.45 29.21,77.72 26.67,77.72 25.4,78.99 X1.9
N$28
  Top 0.254: LED2.K 62.23,68.83 R14.2
N$29  (1 unrouted)
  Bottom 0.254: R15.2 50.8,53.59 52.07,52.32 52.07,45.97 54.61,43.43 60.96,43.43 62.99,45.47 62.99,47.75 62.23,48.51 59.69,48.51 58.12,46.94 J1.3
N$30  (via drill 0.35)  (1 unrouted)
  Top 0.254: v52.07,58.67 51.94,58.67 50.67,57.4 46.28,57.4 45.01,56.13 R17.2
  Bottom 0.254: J1.7 55.3,45.28 53.34,47.24 53.34,58.67 | R16.2 53.34,63.75 53.34,58.67 | v52.07,58.67 53.34,58.67
N$31  (via drill 0.35)
  Top 0.508: R30.1 C18.2 23.81,112.96 v22.86,112.01 | v20.32,109.47 20.32,108.2 IC5.5
  Bottom 0.508: v22.86,112.01 v20.32,109.47
N$32
  Top 0.508: IC5.7 25.08,110.74 R31.2
N$33
  Top 0.254: R27.2 13.33,105.34 R21.1 14.29,105.66 IC5.12
N$34
  Top 0.254: IC5.10 14.29,108.2 R28.1 12.07,110.42 R29.2
N$35
  Top 0.508: IC5.6 22.86,109.47 23.37,108.97 23.37,106.17 22.86,105.66 | 22.86,105.66 IC5.3 | R32.2 24.4,101.17 R33.1 24.4,104.12 22.86,105.66
N$36
  Top 0.508: R33.2 R31.1
N$37
  Top 0.254: IC6.14 48.26,110.95 48.26,113.28 49.53,114.55 50.8,114.55 52.26,113.1 R38.1 54.61,109.66 R39.2
N$39
  Top 0.254: R38.2 R35.1 IC6.13
N$40
  Top 0.254: R37.1 40.32,108.84 R36.2 41.59,109.47 IC6.2
N$41
  Top 0.254: R37.2 IC6.1 43.18,111.3 R34.2
N$42
  Top 0.254: R40.2 51.44,106.11 C20.1 51.44,103.76 R39.1
N$43
  Top 0.254: R40.1 49.09,105.66 48.51,105.66 | 48.51,105.66 IC6.10 | R41.2 48.45,101.82 49.19,102.57 49.19,104.98 48.51,105.66
P1  (via drill 0.35)
  Top 0.254: TP5.TP 4.83,26.67 v10.03,26.67 | C9.1 14.86,24.77 v13.08,26.54
  Top 0.508: v32.89,8 31.62,6.73 25.27,6.73 23.49,4.95 PS1.1 | v25.27,20.7 15.57,20.7 14.86,19.99
  Top 1.27: PS1.1 21.51,4.24 21.46,4.19 16.51,9.14 16.51,14.22 14.3,16.43 L2.2 14.86,19.99 C9.1
  Bottom 0.254: v10.03,26.67 11.36,26.67 R3.1 11.63,26.54 v13.08,26.54
  Bottom 0.508: Z1.2 v32.89,8 | IC1.8 25.91,20.07 v25.27,20.7
P2  (via drill 0.35, 0.35 pad 1)
  Top 0.508: PS1.4 36.7,6.17 v36.7,6.73
  Top 1.27: PS1.4 34.11,4.24 v32.89,5.46
  Bottom 0.508: v36.7,6.73 BR2.2 38.19,6.73 C7.1
  Bottom 1.27: Q1.2 28.37,9.98 v32.89,5.46
PA0_1  (via drill 0.35)
  Top 0.254: X2.1 6.35,124.71 6.35,124.01 Q7.3 v5.78,122.4 R18.2 | v3.56,120.9 3.56,119.67 Z4.3
  Bottom 0.254: v3.56,120.9 5.06,122.4 v5.78,122.4
PA1_1  (via drill 0.35)
  Top 0.254: X2.2 8.48,125.98 8.48,122.64 R19.2 v8.32,121.94 Q8.3 | Z3.3 5.08,117.31 v5.08,118.36
  Bottom 0.254: v8.32,121.94 8.32,121.6 v5.08,118.36
PA2_1
  Top 0.254: X2.3 11.43,124.71 11.43,124.01 Q9.3 10.86,122.4 11.09,122.17 Z2.3 10.63,122.17 R20.2
PA3_1  (via drill 0.35)
  Top 0.254: IC5.13 IC5.14 16.34,100.63 | 16.34,100.63 Z5.3 | v17.78,101.85 16.56,100.63 16.34,100.63
  Bottom 0.254: X2.4 11.43,124.71 11.43,110.04 17.59,103.88 17.59,103.48 17.78,103.3 v17.78,101.85
PA4_1
  Top 0.254: IC5.9 IC5.8 15.24,111.84 15.24,113.28 Z6.3 15.46,119.89 14.84,120.51 14.84,125.59 X2.5
PA5_1  (via drill 0.35)
  Top 0.254: X2.6 18.83,124.93 Z7.3 v20.32,122.17 | R34.1 C19.1
  Bottom 0.254: v20.32,122.17 26.67,122.17 R34.1
PA6_1  (via drill 0.35)
  Top 0.254: Z8.3 20.32,119.85 20.32,121.21 20.95,121.84 20.95,122.51 20.32,123.14 X2.7 | IC6.8 IC6.9 47.74,104.7 47.31,104.7 46.4,105.61 v46.4,106.23
  Bottom 0.254: v46.4,106.23 46.4,118.95 43.56,121.79 27.96,121.79 24.92,124.83 22.38,124.83 21.23,125.98 X2.7
PA7_1  (via drill 0.35)
  Top 0.152: Q5.1 23.75,92.28 23.75,89.54 v24.13,89.15 | v29.21,103.12 29.21,103.63 28.68,104.16 28.68,109.32 28.83,109.47 28.83,120.02 X2.8
  Bottom 0.152: v24.13,89.15 25.4,89.15 25.4,92.96 29.21,96.77 v29.21,103.12
PB0
  Top 0.254: IC3.1 X3.18
PB1
  Top 0.254: IC3.2 5.08,54.86 3.81,53.59 3.81,48.51 5.08,47.24 X3.17
PB2  (via drill 0.35)
  Top 0.254: v29.21,70.1 v24.13,70.1 | IC3.3 7.62,54.86 5.08,52.32 5.08,49.78 7.62,47.24 X3.16
  Bottom 0.254: R15.1 44.45,56.13 44.45,67.56 41.91,70.1 v29.21,70.1 | v24.13,70.1 15.24,70.1 7.62,62.48 IC3.3
PB3  (via drill 0.35)
  Top 0.254: v29.21,68.83 v24.13,68.83 | IC3.4 X3.15
  Bottom 0.254: R16.1 v29.21,68.83 | v24.13,68.83 16.51,68.83 10.16,62.48 IC3.4
PB4
  Top 0.254: IC3.5 X3.14
PB5
  Top 0.254: X3.13 IC3.6
PB6
  Top 0.254: IC3.7 X3.12
PB7
  Top 0.254: X3.11 IC3.8
PD0  (via drill 0.35)
  Top 0.254: IC3.14 32.1,62.48 v24.13,62.48
  Bottom 0.254: v24.13,62.48 22.86,62.48 21.59,61.21 21.59,58.67 20.32,57.4 20.32,54.86 X3.6
PD0_1
  Top 0.254: X4.6 34.8,89.66 34.8,91.39 Q6.1
PD1  (via drill 0.35)
  Top 0.254: IC3.15 33.37,63.75 v24.13,63.75
  Bottom 0.254: v24.13,63.75 21.59,63.75 19.05,61.21 19.05,53.59 X3.7
PD1_1
  Top 0.254: X4.7 31.75,89.15 31.75,89.35 Q2.1
PD2  (via drill 0.35)
  Top 0.254: IC3.16 34.64,65.02 v24.13,65.02
  Bottom 0.254: v24.13,65.02 20.32,65.02 16.51,61.21 16.51,53.59 X3.8
PD2_1
  Top 0.254: X4.8 27.94,88.21 28.82,89.1 28.82,92.28 Q3.1
PD3  (via drill 0.35)
  Top 0.254: IC3.17 35.91,66.29 v24.13,66.29
  Bottom 0.254: v24.13,66.29 19.05,66.29 13.97,61.21 13.97,53.59 X3.9
PD3_1
  Top 0.254: X4.9 26.67,89.15 26.67,89.35 Q4.1
PD5  (via drill 0.35)
  Top 0.254: IC3.19 39.72,67.56 v24.13,67.56
  Bottom 0.254: v24.13,67.56 17.78,67.56 11.43,61.21 11.43,53.59 X3.10
PD5_1  (via drill 0.35)
  Top 0.152: R30.2 v16.51,115.82 | v12.7,115.82 8.26,111.38 8.26,96.14 8.89,95.5 15.24,95.5 v20.32,90.42
  Bottom 0.152: v16.51,115.82 v12.7,115.82 | v20.32,90.42 X4.10
RST
  Top 0.254: R13.1 62.23,77.99 S1.3 S1.4 55.17,77.01 50.8,72.64 24.13,72.64 22.86,71.37 IC3.9
S1  (via drill 0.35, 0.35 pad 0.7)
  Top 0.254: v37.34,30.23 35.43,32.13 32.89,32.13 31.01,34.01 PS1.10
  Top 1.27: PS1.12 PS1.11 | PS1.10 PS1.11 | PS1.11 27.25,31.42 v27.81,30.86
  Bottom 0.254: IC2.5 37.99,29.61 37.97,29.59 v37.34,30.23 | D3.3 30.35,30.86
  Bottom 0.508: C8.1 27.81,34.22 v27.81,30.86
  Bottom 1.27: 30.35,30.86 v27.81,30.86
S2  (via drill 0.35)
  Top 0.254: 40.51,34.62 v40.51,33.4
  Top 1.27: PS1.9 PS1.8 40.51,34.62 PS1.7 42.34,34.67 50.67,34.67 JP4.1 52.12,33.22 52.12,20.6 C5.1 C6.1 C3.1
  Bottom 0.254: IC2.1 39.54,32.13 39.54,32.56 40.39,33.4 v40.51,33.4 | JP4.1 50.8,32 JP3.1
SENSE
  Bottom 0.254: R2.1 19.92,14.62 TP2.TP
  Bottom 0.508: R2.1 R1.1
  Bottom 1.27: Q1.3 20.87,11.54 R1.1
SGND  (via drill 0.35 pad 0.7)
  Top 0.254: LED1.1 48.02,22.08
  Top 1.27: JP5.1 49.45,10.49 C3.2 C6.2 C5.2 49.45,20.65 48.18,21.92 | 48.02,22.08 v43.05,27.05
  Bottom 0.254: IC2.3 IC2.2 40.24,31.84 40.24,31.28 39.83,30.86 35.75,30.86
  Bottom 0.508: D3.2 35.34,32.19 R11.2
  Bottom 1.27: D3.2 35.75,30.86 D3.1 38.64,27.05 v43.05,27.05
  pour Bottom: 20.32,37.08 53.34,37.08 53.34,0.25 48.26,0.25 48.26,20.57 43.18,25.65 35.56,25.65 34.29,26.92 30.48,26.92 26.67,30.73 25.4,30.73 20.32,35.81
V+  (via drill 0.35 pad 0.8)
  Top 1.27: L2.1 v11.3,10.29
  Bottom 1.27: v11.3,10.29 9.73,11.86 8.89,11.86 BR1.1 8.75,13.22 7.87,14.1 C1.1
VDD  (via drill 0.35)
  Top 0.254: v37.85,19.56 40.39,19.56 v40.51,19.43 41.78,18.16 41.78,14.35 49.53,6.6 TP1.TP
  Bottom 0.254: IC1.1 33.98,20.07 C2.1 C4.1 37.52,19.88 v37.85,19.56 | R12.2 v40.51,19.43
VS
  Bottom 0.508: IC1.2 33.62,18.8 R5.1 34.26,16.99 33.71,16.44 R4.2
XTAL1
  Bottom 0.254: C10.1 36.63,51.25 Y1.2 33.02,58.47 IC3.13
XTAL2
  Bottom 0.254: C11.1 Y1.1 30.48,56.13 IC3.12

### Text on the board
CustomSilk: 4_1 | Li'l Matto D5 Interface Shield | early revision | Trimmable / DAC | MOSFET ARRAY / VGS 5V / VDS 3V3 | 1_1 | 2_1 | Ideal Op-Amp Rectifier | 3_1 | Voltage Divider + Unity Follower / 5V to 3V3 Analog | MOSFET ARRAY / VGS 3V3 / VDS 5V | 0 | 1 | 2 | 3 | 4 | 5 | 6 | 6 | 7 | 7 | 6 | 5 | 4 | 3 | 2 | 1 | 0 | PORT A | ADC PORTS | PORT C | doki / doki | kono kurai basho de / nani wo suru tsumori / desu ka | (; - w-) | Derived from Il Matto | Li'l Matto | 15V IN | kaicho no tsukurimono desu~ | PORT B | PORT D | 3V3 | GND | 5V | 0 | 1 | 2 | 3 | 4 | 5 | 6 | 7 | 5 | 3 | 2 | 1 | 0 | GND